# EAGLE board n64adv2 (EAGLE 9.6.2), part 1 of 2
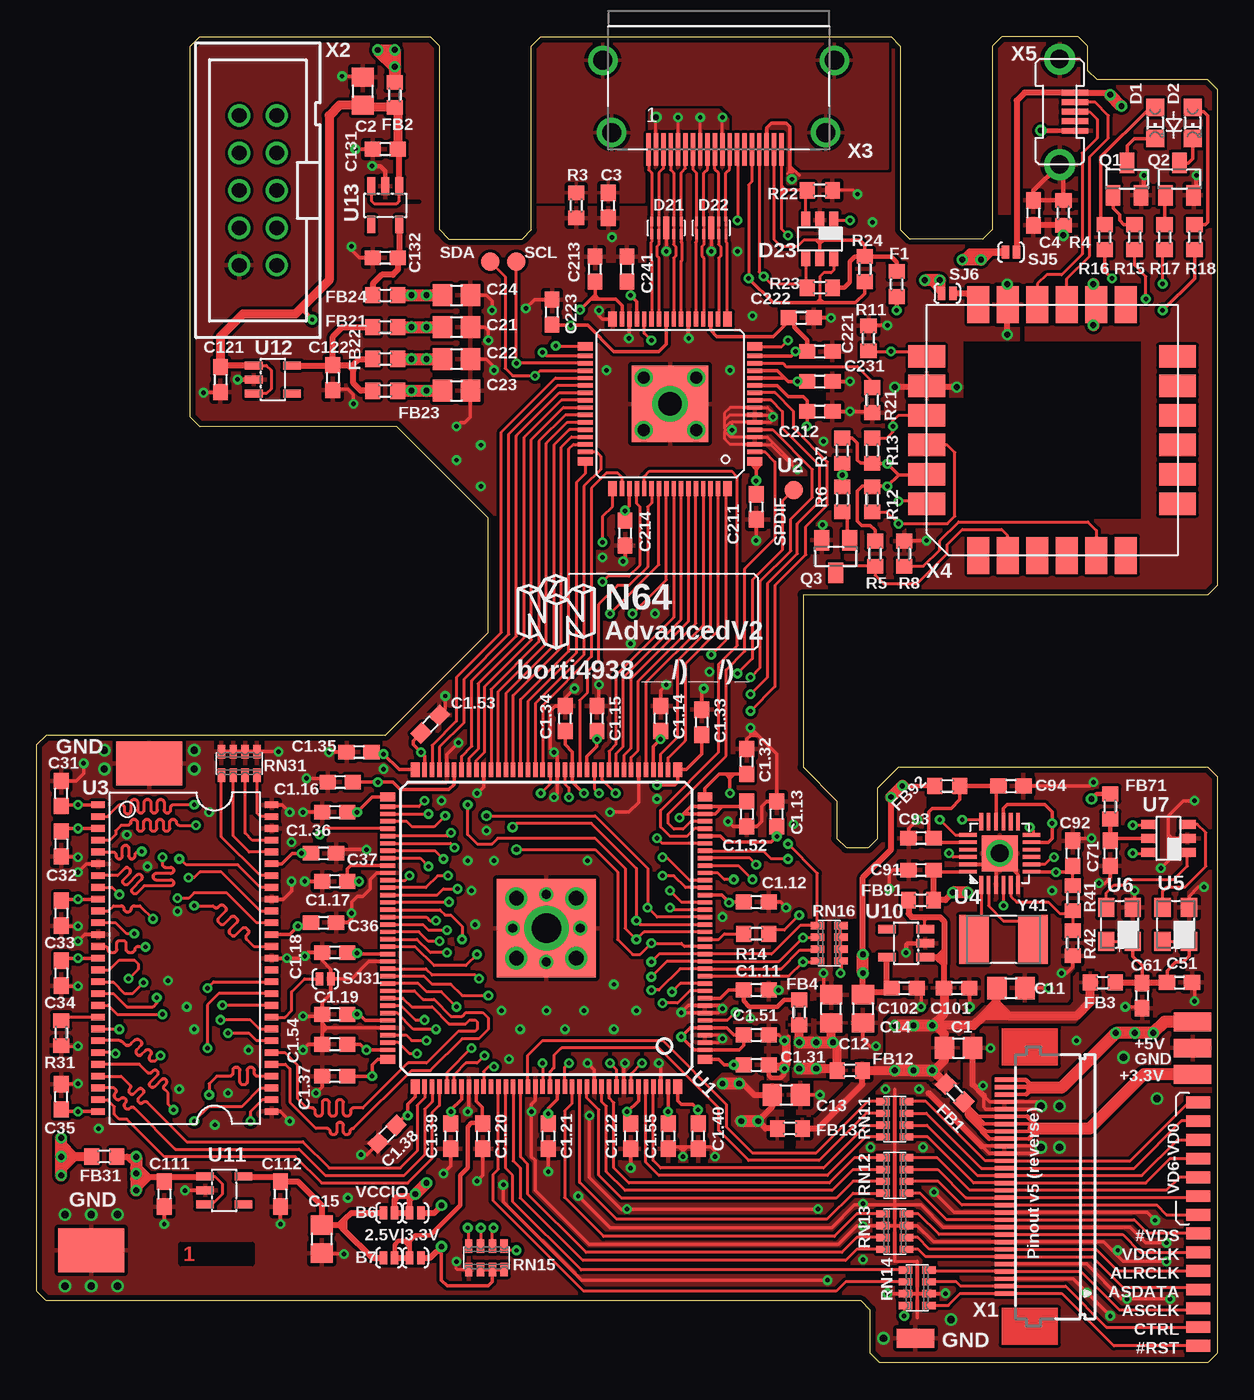
[diagram p4: board, top side]
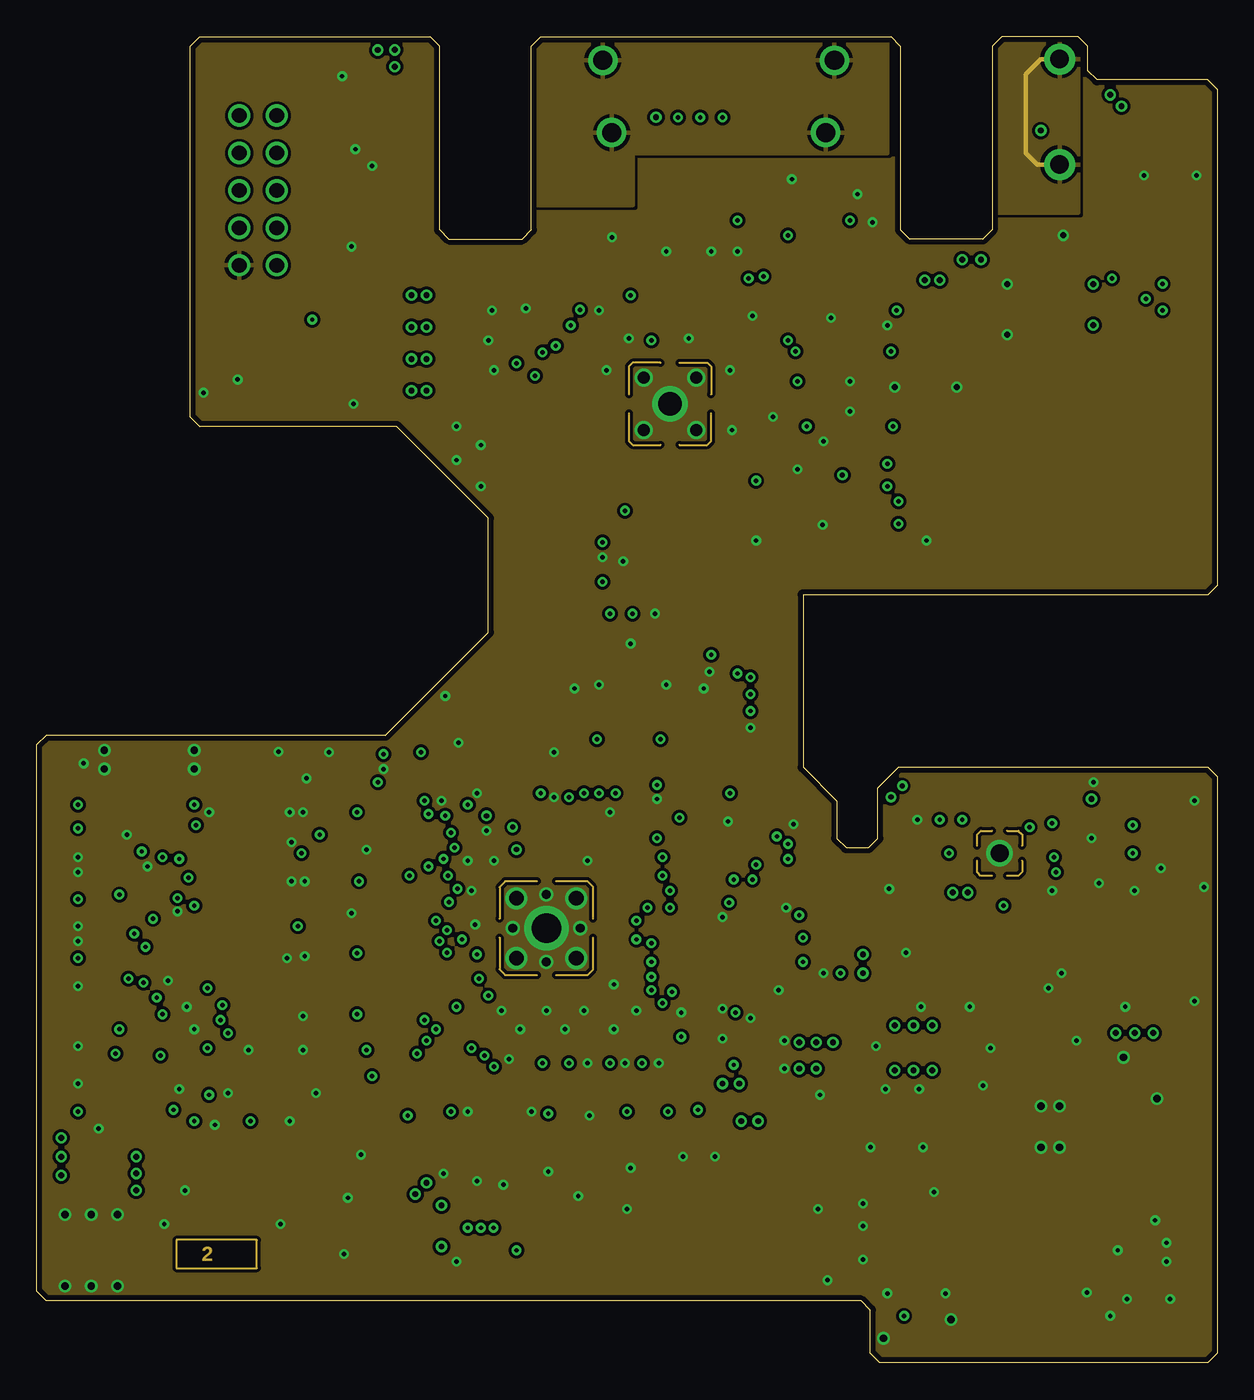
[diagram p5: board, inner layer Route2]
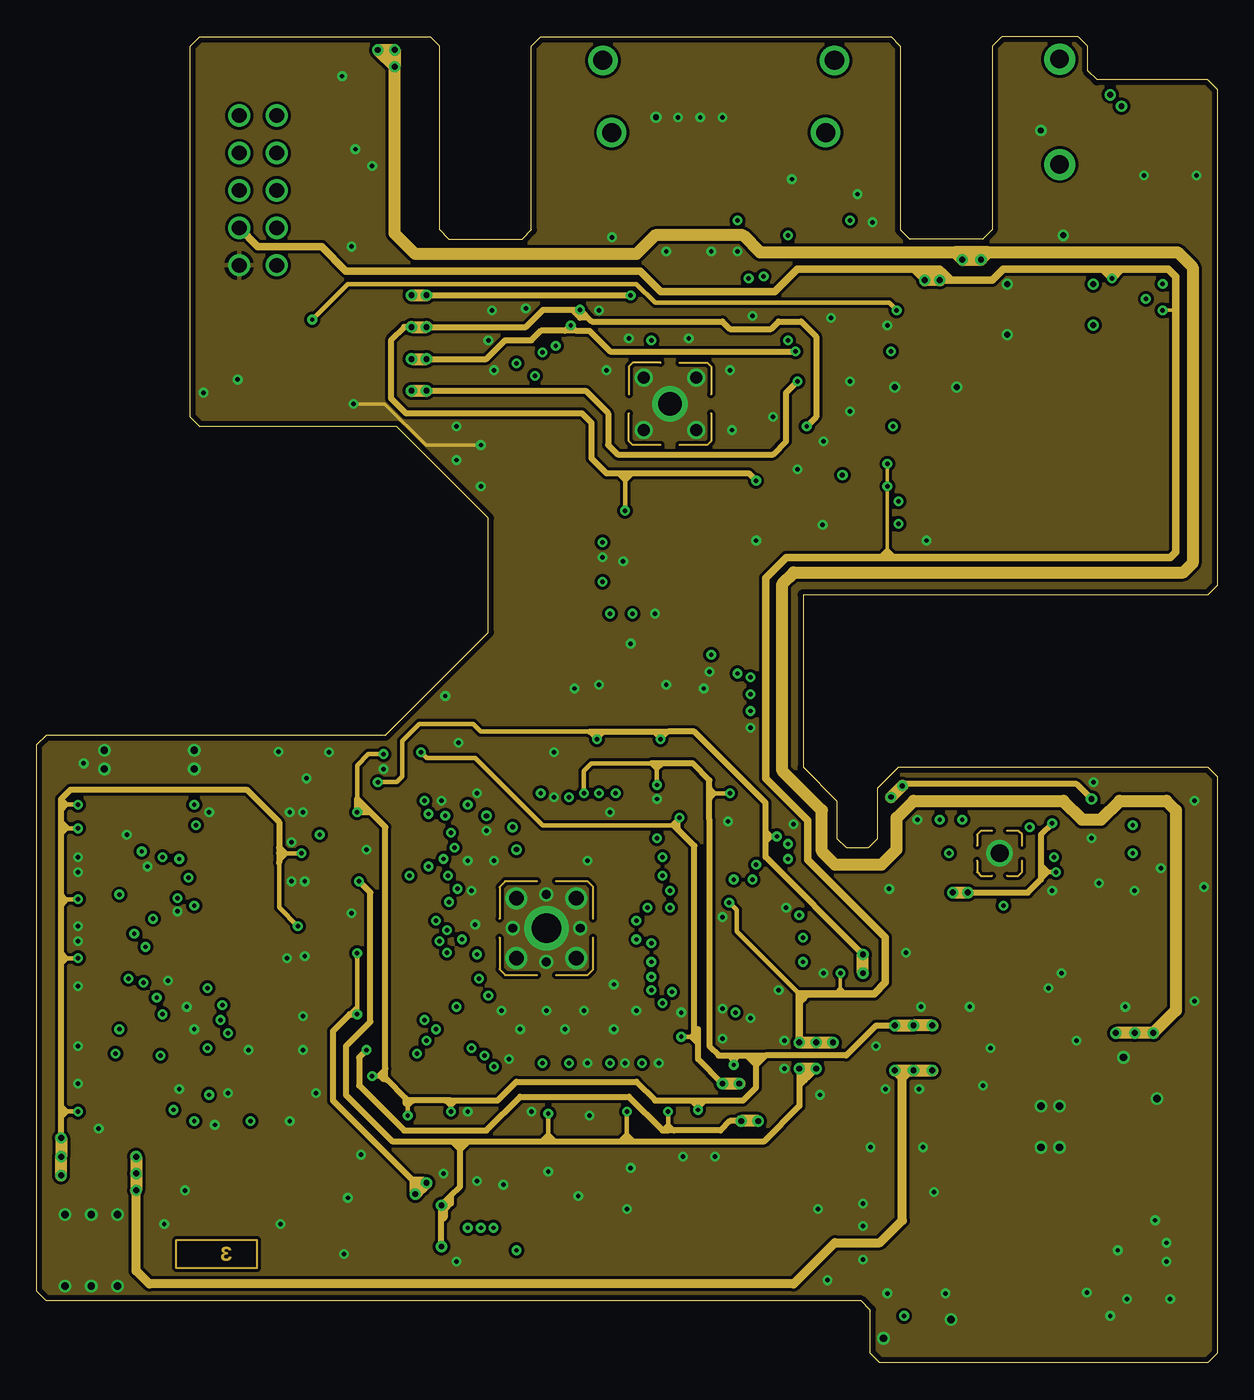
[diagram p6: board, inner layer Route15]
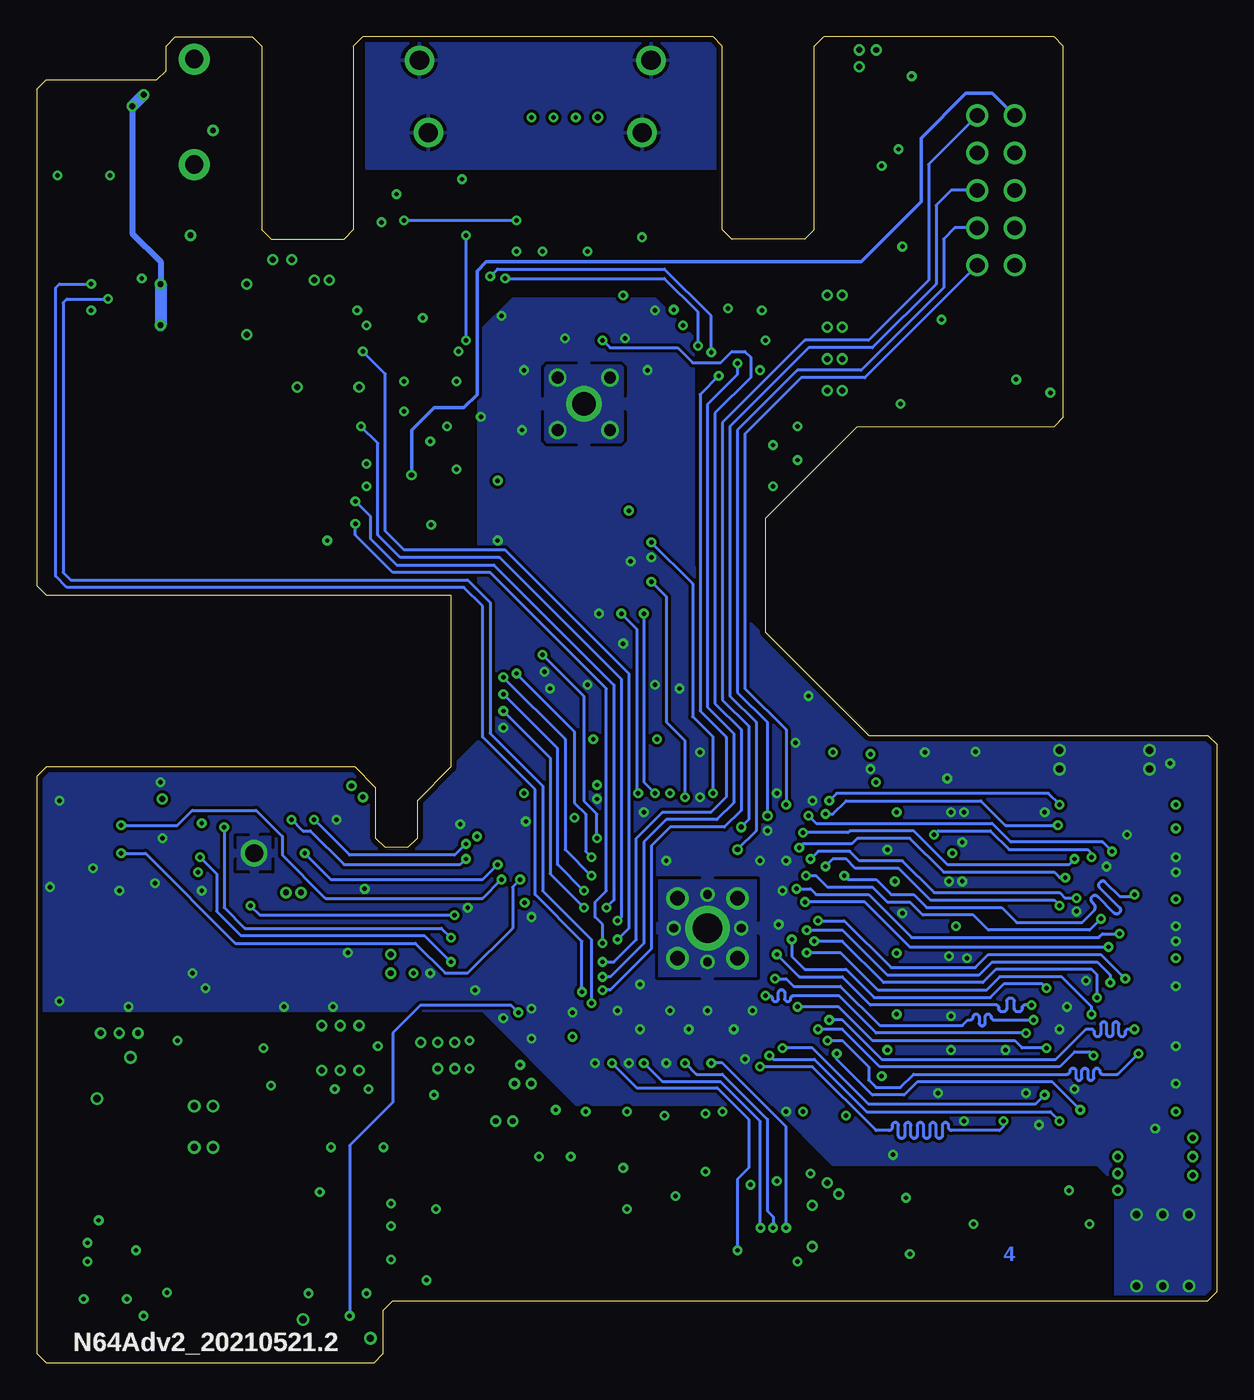
[diagram p7: board, bottom side, seen from below]

Size 80.01 x 89.92 mm. Coordinates in mm from the lower left corner, seen from the top.
Outline: 55.88,4.19 0.64,4.19 0,4.83 0,41.91 0.64,42.55 23.62,42.55 30.61,49.53 30.61,57.28 24.38,63.5 11.05,63.5 10.41,64.14 10.41,89.28 11.05,89.92 26.67,89.92 27.3,89.28 27.3,76.83 27.94,76.2 32.89,76.2 33.53,76.83 33.53,89.28 34.16,89.92 57.91,89.92 58.55,89.28 58.55,76.83 59.18,76.2 64.14,76.2 64.77,76.83 64.77,89.28 65.41,89.92 70.61,89.92 71.25,89.28 71.25,87.63 71.88,87 79.38,87 80.01,86.36 80.01,52.7 79.38,52.07 51.94,52.07 51.94,40.39 54.23,38.1 54.23,35.56 54.86,34.92 56.39,34.92 57.02,35.56 57.02,38.99 58.42,40.39 79.38,40.39 80.01,39.75 80.01,0.64 79.38,0 57.15,0 56.52,0.64 56.52,3.56 55.88,4.19
Copper layers (1+2*15+16): Top 0.0356mm / dielectric 0.2mm / Route2 0.0175mm / dielectric 1.1mm / Route15 0.0175mm / dielectric 0.2mm / Bottom 0.0356mm
Design rules "LaenPCBOrder_4Layer *": minimum track width 6mil, minimum drill 10mil, track to track 0.2mm, track to pad 0.2mm, pad to pad 0.2mm, via to via 0.2mm, smd to smd 6mil, copper to edge 15mil, drill to drill 6mil, minimum pad ring 7mil, minimum via ring 7mil, stop-mask expansion 3mil, vias tented up to drill 30mil, thermal gap 10mil
tRestrict: area 9.7,6.6 to 14.7,8.1; 17 lines
bRestrict: area 9.7,6.6 to 14.7,8.1; 28 lines

## Footprints (pad centres in the part's own frame; a part is rotated, then mirrored left to right if it is on the bottom)
SMD1,27-2,54 = smd 1.27 x 2.54: 1 0,0
SMD0,8-1,6 = smd 0.8 x 1.6: P$1 0,0
C0805 = smd 1.3 x 1.5: 1 -0.95,0; 2 0.95,0
C0603 = smd 1.1 x 1: 1 -0.85,0; 2 0.85,0
CHIPLED_0805 = smd 1.2 x 1.2: A 0,-1.05; C 0,1.05
HDMI_RCLAMP = smd 0.2 x 0.675: 1 -1,-0.438; 2 -0.5,-0.438; 4 0.5,-0.438; 5 1,-0.438; 6 1,0.438; 7 0.5,0.438; 9 -0.5,0.438; 10 -1,0.438 | smd 0.4 x 1.55: 3 0,0
SOT-23-6 = smd 1.1 x 0.6: 1 -1.3,0.95; 2 -1.3,0; 3 -1.3,-0.95; 4 1.3,-0.95; 5 1.3,0; 6 1.3,0.95
R0603 = smd 1 x 1.1: 1 -0.85,0; 2 0.85,0
SOT23 = smd 1 x 1.4: 1 -0.95,-1.1; 2 0.95,-1.1; 3 0,1.1
CTS742C083 = smd 0.5 x 0.9: 1 -1.2,-0.8; 2 -0.4,-0.8; 3 0.4,-0.8; 4 1.2,-0.8; 5 1.2,0.8; 6 0.4,0.8; 7 -0.4,0.8; 8 -1.2,0.8
GND_FINGER_PAD = smd 4.5 x 3: P$1 0,0
SJ_SMALL = smd 0.508 x 0.889: 1 -0.381,0; 2 0.381,0
B1,27 = smd 1.27 x 1.27: TP 0,0
EQFP144_2 = smd 1 x 0.6: 1 -10.75,8.9; 36 -10.75,-8.9; 73 10.75,-8.9; 108 10.75,8.9 | smd 1 x 0.3: 2 -10.75,8.25; 3 -10.75,7.75; 4 -10.75,7.25; 5 -10.75,6.75; 6 -10.75,6.25; 7 -10.75,5.75; 8 -10.75,5.25; 9 -10.75,4.75; 10 -10.75,4.25; 11 -10.75,3.75; 12 -10.75,3.25; 13 -10.75,2.75; 14 -10.75,2.25; 15 -10.75,1.75; 16 -10.75,1.25; 17 -10.75,0.75; 18 -10.75,0.25; 19 -10.75,-0.25; 20 -10.75,-0.75; 21 -10.75,-1.25; 22 -10.75,-1.75; 23 -10.75,-2.25; 24 -10.75,-2.75; 25 -10.75,-3.25; 26 -10.75,-3.75; 27 -10.75,-4.25; 28 -10.75,-4.75; 29 -10.75,-5.25; 30 -10.75,-5.75; 31 -10.75,-6.25; 32 -10.75,-6.75; 33 -10.75,-7.25; 34 -10.75,-7.75; 35 -10.75,-8.25; 74 10.75,-8.25; 75 10.75,-7.75; 76 10.75,-7.25; 77 10.75,-6.75; 78 10.75,-6.25; 79 10.75,-5.75; 80 10.75,-5.25; 81 10.75,-4.75; 82 10.75,-4.25; 83 10.75,-3.75; 84 10.75,-3.25; 85 10.75,-2.75; 86 10.75,-2.25; 87 10.75,-1.75; 88 10.75,-1.25; 89 10.75,-0.75; 90 10.75,-0.25; 91 10.75,0.25; 92 10.75,0.75; 93 10.75,1.25; 94 10.75,1.75; 95 10.75,2.25; 96 10.75,2.75; 97 10.75,3.25; 98 10.75,3.75; 99 10.75,4.25; 100 10.75,4.75; 101 10.75,5.25; 102 10.75,5.75; 103 10.75,6.25; 104 10.75,6.75; 105 10.75,7.25; 106 10.75,7.75; 107 10.75,8.25 | smd 0.6 x 1: 37 -8.9,-10.75; 72 8.9,-10.75; 109 8.9,10.75; 144 -8.9,10.75 | smd 0.3 x 1: 38 -8.25,-10.75; 39 -7.75,-10.75; 40 -7.25,-10.75; 41 -6.75,-10.75; 42 -6.25,-10.75; 43 -5.75,-10.75; 44 -5.25,-10.75; 45 -4.75,-10.75; 46 -4.25,-10.75; 47 -3.75,-10.75; 48 -3.25,-10.75; 49 -2.75,-10.75; 50 -2.25,-10.75; 51 -1.75,-10.75; 52 -1.25,-10.75; 53 -0.75,-10.75; 54 -0.25,-10.75; 55 0.25,-10.75; 56 0.75,-10.75; 57 1.25,-10.75; 58 1.75,-10.75; 59 2.25,-10.75; 60 2.75,-10.75; 61 3.25,-10.75; 62 3.75,-10.75; 63 4.25,-10.75; 64 4.75,-10.75; 65 5.25,-10.75; 66 5.75,-10.75; 67 6.25,-10.75; 68 6.75,-10.75; 69 7.25,-10.75; 70 7.75,-10.75; 71 8.25,-10.75; 110 8.25,10.75; 111 7.75,10.75; 112 7.25,10.75; 113 6.75,10.75; 114 6.25,10.75; 115 5.75,10.75; 116 5.25,10.75; 117 4.75,10.75; 118 4.25,10.75; 119 3.75,10.75; 120 3.25,10.75; 121 2.75,10.75; 122 2.25,10.75; 123 1.75,10.75; 124 1.25,10.75; 125 0.75,10.75; 126 0.25,10.75; 127 -0.25,10.75; 128 -0.75,10.75; 129 -1.25,10.75; 130 -1.75,10.75; 131 -2.25,10.75; 132 -2.75,10.75; 133 -3.25,10.75; 134 -3.75,10.75; 135 -4.25,10.75; 136 -4.75,10.75; 137 -5.25,10.75; 138 -5.75,10.75; 139 -6.25,10.75; 140 -6.75,10.75; 141 -7.25,10.75; 142 -7.75,10.75; 143 -8.25,10.75 | smd 6.7 x 6.7: E 0,0
LQFP64_EP = smd 1 x 0.6: 1 -5.75,3.9; 16 -5.75,-3.9; 33 5.75,-3.9; 48 5.75,3.9 | smd 1 x 0.3: 2 -5.75,3.25; 3 -5.75,2.75; 4 -5.75,2.25; 5 -5.75,1.75; 6 -5.75,1.25; 7 -5.75,0.75; 8 -5.75,0.25; 9 -5.75,-0.25; 10 -5.75,-0.75; 11 -5.75,-1.25; 12 -5.75,-1.75; 13 -5.75,-2.25; 14 -5.75,-2.75; 15 -5.75,-3.25; 34 5.75,-3.25; 35 5.75,-2.75; 36 5.75,-2.25; 37 5.75,-1.75; 38 5.75,-1.25; 39 5.75,-0.75; 40 5.75,-0.25; 41 5.75,0.25; 42 5.75,0.75; 43 5.75,1.25; 44 5.75,1.75; 45 5.75,2.25; 46 5.75,2.75; 47 5.75,3.25 | smd 0.6 x 1: 17 -3.9,-5.75; 32 3.9,-5.75; 49 3.9,5.75; 64 -3.9,5.75 | smd 0.3 x 1: 18 -3.25,-5.75; 19 -2.75,-5.75; 20 -2.25,-5.75; 21 -1.75,-5.75; 22 -1.25,-5.75; 23 -0.75,-5.75; 24 -0.25,-5.75; 25 0.25,-5.75; 26 0.75,-5.75; 27 1.25,-5.75; 28 1.75,-5.75; 29 2.25,-5.75; 30 2.75,-5.75; 31 3.25,-5.75; 50 3.25,5.75; 51 2.75,5.75; 52 2.25,5.75; 53 1.75,5.75; 54 1.25,5.75; 55 0.75,5.75; 56 0.25,5.75; 57 -0.25,5.75; 58 -0.75,5.75; 59 -1.25,5.75; 60 -1.75,5.75; 61 -2.25,5.75; 62 -2.75,5.75; 63 -3.25,5.75 | smd 5.2 x 5.2: EXP 0,0
TSOP-54 = smd 0.9 x 0.45: 1 -5.88,10.4; 2 -5.88,9.6; 3 -5.88,8.8; 4 -5.88,8; 5 -5.88,7.2; 6 -5.88,6.4; 7 -5.88,5.6; 8 -5.88,4.8; 9 -5.88,4; 10 -5.88,3.2; 11 -5.88,2.4; 12 -5.88,1.6; 13 -5.88,0.8; 14 -5.88,0; 15 -5.88,-0.8; 16 -5.88,-1.6; 17 -5.88,-2.4; 18 -5.88,-3.2; 19 -5.88,-4; 20 -5.88,-4.8; 21 -5.88,-5.6; 22 -5.88,-6.4; 23 -5.88,-7.2; 24 -5.88,-8; 25 -5.88,-8.8; 26 -5.88,-9.6; 27 -5.88,-10.4; 28 5.88,-10.4; 29 5.88,-9.6; 30 5.88,-8.8; 31 5.88,-8; 32 5.88,-7.2; 33 5.88,-6.4; 34 5.88,-5.6; 35 5.88,-4.8; 36 5.88,-4; 37 5.88,-3.2; 38 5.88,-2.4; 39 5.88,-1.6; 40 5.88,-0.8; 41 5.88,0; 42 5.88,0.8; 43 5.88,1.6; 44 5.88,2.4; 45 5.88,3.2; 46 5.88,4; 47 5.88,4.8; 48 5.88,5.6; 49 5.88,6.4; 50 5.88,7.2; 51 5.88,8; 52 5.88,8.8; 53 5.88,9.6; 54 5.88,10.4
QFN-24-DIY = smd 2.45 x 2.45: EXP 0,0 | smd 1.2 x 0.25: P1 -2.15,1.25; P2 -2.15,0.75; P3 -2.15,0.25; P4 -2.15,-0.25; P5 -2.15,-0.75; P6 -2.15,-1.25; P13 2.15,-1.25; P14 2.15,-0.75; P15 2.15,-0.25; P16 2.15,0.25; P17 2.15,0.75; P18 2.15,1.25 | smd 0.25 x 1.2: P7 -1.25,-2.15; P8 -0.75,-2.15; P9 -0.25,-2.15; P10 0.25,-2.15; P11 0.75,-2.15; P12 1.25,-2.15; P19 1.25,2.15; P20 0.75,2.15; P21 0.25,2.15; P22 -0.25,2.15; P23 -0.75,2.15; P24 -1.25,2.15
3.2X2.5_KXO-V96 = smd 1.3 x 1.1: 1 -1.15,-0.9; 2 1.15,-0.9; 3 1.15,0.9; 4 -1.15,0.9
SOT23-5 = smd 0.55 x 1.2: 1 -0.95,-1.3; 2 0,-1.3; 3 0.95,-1.3; 4 0.95,1.3; 5 -0.95,1.3
FH12-30S-0.5SH = smd 0.3 x 1.3: 1 -7.25,3.25; 2 -6.75,3.25; 3 -6.25,3.25; 4 -5.75,3.25; 5 -5.25,3.25; 6 -4.75,3.25; 7 -4.25,3.25; 8 -3.75,3.25; 9 -3.25,3.25; 10 -2.75,3.25; 11 -2.25,3.25; 12 -1.75,3.25; 13 -1.25,3.25; 14 -0.75,3.25; 15 -0.25,3.25; 16 0.25,3.25; 17 0.75,3.25; 18 1.25,3.25; 19 1.75,3.25; 20 2.25,3.25; 21 2.75,3.25; 22 3.25,3.25; 23 3.75,3.25; 24 4.25,3.25; 25 4.75,3.25; 26 5.25,3.25; 27 5.75,3.25; 28 6.25,3.25; 29 6.75,3.25; 30 7.25,3.25
PAK100/2500-10 = drill 1 pad 1.422: 1 -5.08,-1.27; 2 -5.08,1.27; 3 -2.54,-1.27; 4 -2.54,1.27; 5 0,-1.27; 6 0,1.27; 7 2.54,-1.27; 8 2.54,1.27; 9 5.08,-1.27; 10 5.08,1.27
685119134923 = smd 0.3 x 2.2: 1 4.75,0.15; 2 4.25,0.15; 3 3.75,0.15; 4 3.25,0.15; 5 2.75,0.15; 6 2.25,0.15; 7 1.75,0.15; 8 1.25,0.15; 9 0.75,0.15; 10 0.25,0.15; 11 -0.25,0.15; 12 -0.75,0.15; 13 -1.25,0.15; 14 -1.75,0.15; 15 -2.25,0.15; 16 -2.75,0.15; 17 -3.25,0.15; 18 -3.75,0.15; 19 -4.25,0.15 | drill 1.3 pad 2: SHELL -7.25,-1; SHELL1 7.25,-1; SHELL2 -7.85,-5.9; SHELL3 7.85,-5.9
TEI0005 = smd 2.5 x 1.5: 1 -8.5,5; 2 -8.5,3; 3 -8.5,1; 4 -8.5,-1; 5 -8.5,-3; 6 -8.5,-5; 13 8.5,-5; 14 8.5,-3; 15 8.5,-1; 16 8.5,1; 17 8.5,3; 18 8.5,5 | smd 1.5 x 2.5: 7 -5,-8.5; 8 -3,-8.5; 9 -1,-8.5; 10 1,-8.5; 11 3,-8.5; 12 5,-8.5; 19 5,8.5; 20 3,8.5; 21 1,8.5; 22 -1,8.5; 23 -3,8.5; 24 -5,8.5
USB-MICRO-VERTICAL-DIY = smd 0.4 x 1.8: 1 -1.3,1.04; 2 -0.65,1.04; 3 0,1.04; 4 0.65,1.04; 5 1.3,1.04 | drill 1.25 pad 2.1: 6 -3.575,0; 7 3.575,0
5.0X3.2_2 = smd 2 x 3.3: 1 -2,0; 2 2,0

## Placement (x,y rotation side)
3V_IN  [SMD1,27-2,54]  78.36,19.56 90 top
#RST  SMD1  [SMD0,8-1,6]  78.74,1.14 90 top
#VDS  SMD1  [SMD0,8-1,6]  78.74,8.76 270 top
ALRCLK  SMD1  [SMD0,8-1,6]  78.74,6.22 270 top
ASCLK  SMD1  [SMD0,8-1,6]  78.74,3.68 270 top
ASDATA  SMD1  [SMD0,8-1,6]  78.74,4.95 270 top
C1  47u  [C0805]  62.48,21.34 0 top
C1.11  0.1u  [C0603]  48.77,25.27 0 top
C1.12  0.1u  [C0603]  48.77,31.24 0 top
C1.13  0.1u  [C0603]  50.16,37.21 90 top
C1.14  0.1u  [C0603]  42.29,43.69 90 top
C1.15  0.1u  [C0603]  37.97,43.69 90 top
C1.16  0.1u  [C0603]  20.57,39.37 180 top
C1.17  0.1u  [C0603]  20.19,32.64 180 top
C1.18  0.1u  [C0603]  20.19,27.81 180 top
C1.19  0.1u  [C0603]  20.19,23.62 180 top
C1.20  0.1u  [C0603]  30.23,15.37 270 top
C1.21  0.1u  [C0603]  34.67,15.37 270 top
C1.22  0.1u  [C0603]  40.26,15.37 270 top
C1.31  0.1u  [C0603]  48.77,20.19 0 top
C1.32  0.1u  [C0603]  48.13,40.77 90 top
C1.33  0.1u  [C0603]  45.09,43.43 90 top
C1.34  0.1u  [C0603]  35.81,43.69 90 top
C1.35  0.1u  [C0603]  21.84,41.4 180 top
C1.36  0.1u  [C0603]  20.19,37.34 180 top
C1.37  0.1u  [C0603]  20.19,19.43 180 top
C1.38  0.1u  [C0603]  23.75,15.49 225 top
C1.39  0.1u  [C0603]  28.07,15.37 270 top
C1.40  0.1u  [C0603]  44.83,15.37 270 top
C1.51  0.1u  [C0603]  48.77,22.23 0 top
C1.52  0.1u  [C0603]  48.13,37.21 270 top
C1.53  0.1u  [C0603]  26.67,43.31 45 top
C1.54  0.1u  [C0603]  20.19,21.59 180 top
C1.55  0.1u  [C0603]  42.8,15.37 270 top
C2  47u  [C0805]  22.1,86.23 90 top
C3  0.1u  [C0603]  38.73,78.49 90 top
C4  0.1u  [C0603]  67.56,77.98 90 top
C11  10u  [C0805]  66.04,25.4 0 top
C12  10u  [C0805]  53.85,24 90 top
C13  10u  [C0805]  50.8,18.16 0 top
C14  10u  [C0805]  56.01,24 270 top
C15  10u  [C0805]  19.3,8.38 270 top
C21  10u  [C0805]  28.45,70.23 0 top
C22  10u  [C0805]  28.45,68.07 0 top
C23  10u  [C0805]  28.45,65.91 0 top
C24  10u  [C0805]  28.45,72.39 0 top
C31  0.1u  [C0603]  1.65,38.61 90 top
C32  0.1u  [C0603]  1.65,35.18 270 top
C33  0.1u  [C0603]  1.65,30.48 270 top
C34  0.1u  [C0603]  1.65,26.42 270 top
C35  0.1u  [C0603]  1.65,18.03 90 top
C36  0.1u  [C0603]  19.43,29.84 0 top
C37  0.1u  [C0603]  19.43,34.54 0 top
C51  0.01u  [C0603]  77.47,25.78 0 top
C61  0.01u  [C0603]  74.93,24.89 270 top
C71  0.1u  [C0603]  72.77,34.54 270 top
C91  0.1u  [C0603]  59.94,33.4 180 top
C92  0.1u  [C0603]  70.23,34.54 90 top
C93  0.1u  [C0603]  59.94,35.56 180 top
C94  0.1u  [C0603]  66.04,39.12 0 top
C101  1u  [C0603]  62.36,25.4 0 top
C102  1u  [C0603]  58.8,25.4 0 top
C111  1u  [C0603]  8.64,11.43 270 top
C112  1u  [C0603]  16.51,11.43 270 top
C121  1u  [C0603]  12.45,66.67 270 top
C122  1u  [C0603]  20.07,66.8 270 top
C131  1u  [C0603]  23.62,82.3 180 top
C132  1u  [C0603]  23.62,74.93 180 top
C211  0.1u  [C0603]  48.77,58.04 270 top
C212  0.1u  [C0603]  53.09,64.52 0 top
C213  0.1u  [C0603]  37.85,74.17 90 top
C214  0.1u  [C0603]  39.88,56.26 270 top
C221  0.1u  [C0603]  53.09,68.58 0 top
C222  0.1u  [C0603]  51.82,70.87 0 top
C223  0.1u  [C0603]  34.92,71.25 90 top
C231  0.1u  [C0603]  53.09,66.55 0 top
C241  0.1u  [C0603]  40.01,74.17 90 top
CTRL  SMD1  [SMD0,8-1,6]  78.74,2.41 90 top
D1  LTST-C194KRKT  [CHIPLED_0805]  75.82,84.07 180 top
D2  LTST-C194KGKT  [CHIPLED_0805]  78.36,84.07 180 top
D21  RCLAMP0524PATCT  [HDMI_RCLAMP]  42.67,76.96 0 top
D22  RCLAMP0524PATCT  [HDMI_RCLAMP]  45.72,76.96 180 top
D23  2G17TI_DBV  [SOT-23-6]  53.09,76.2 270 top
F1  [R0603]  58.29,73.15 90 top
FB1  MPZ1608S221A  [R0603]  62.23,18.29 135 top
FB2  MPZ1608S221A  [R0603]  24.26,85.98 270 top
FB3  MPZ1608S221A  [R0603]  72.26,25.78 0 top
FB4  MPZ1608S221A  [R0603]  51.69,23.75 90 top
FB12  MPZ1608S221A  [R0603]  55.12,19.81 180 top
FB13  MPZ1608S221A  [R0603]  51.05,15.88 180 top
FB21  MPZ1608S221A  [R0603]  23.62,70.23 0 top
FB22  MPZ1608S221A  [R0603]  23.62,68.07 0 top
FB23  MPZ1608S221A  [R0603]  23.62,65.91 0 top
FB24  MPZ1608S221A  [R0603]  23.62,72.39 0 top
FB31  MPZ1608S221A  [R0603]  4.57,13.97 180 top
FB71  MPZ1608S221A  [R0603]  72.77,37.72 270 top
FB91  MPZ1608S221A  [R0603]  59.94,31.37 0 top
FB92  MPZ1608S221A  [R0603]  61.72,39.12 0 top
P_5V_IN  [SMD1,27-2,54]  78.36,23.11 270 top
P_GND_2  [SMD1,27-2,54]  59.56,1.65 90 top
P_GND_3  [SMD1,27-2,54]  78.36,21.34 90 top
Q1  2N2222  [SOT23]  73.91,80.26 0 top
Q2  2N2222  [SOT23]  77.47,80.26 0 top
Q3  2N2222  [SOT23]  54.17,54.67 180 top
R3  1M  [R0603]  36.58,78.49 90 top
R4  1M  [R0603]  69.6,77.98 90 top
R5  1k  [R0603]  56.83,54.86 90 top
R6  1k  [R0603]  54.61,58.55 270 top
R7  1k  [R0603]  54.61,61.85 90 top
R8  10k  [R0603]  58.8,54.86 270 top
R11  1k  [R0603]  56.39,69.47 90 top
R12  10k  [R0603]  56.64,58.55 90 top
R13  10k  [R0603]  56.64,61.85 270 top
R14  33  [R0603]  48.77,29.08 180 top
R15  1k  [R0603]  74.42,76.33 270 top
R16  330  [R0603]  72.39,76.33 270 top
R17  1k  [R0603]  76.45,76.33 270 top
R18  330  [R0603]  78.49,76.33 270 top
R21  887  [R0603]  56.64,65.28 90 top
R22  10k  [R0603]  53.09,79.5 180 top
R23  2k  [R0603]  53.09,72.9 180 top
R24  2k  [R0603]  56.13,74.17 270 top
R31  1k  [R0603]  1.65,22.35 270 top
R41  3k09  [R0603]  70.23,31.5 270 top
R42  1k58  [R0603]  70.23,28.45 90 top
RN11  BK32164M121-T  [CTS742C083]  58.17,16.51 270 top
RN12  BK32164M121-T  [CTS742C083]  58.17,12.7 270 top
RN13  BK32164M121-T  [CTS742C083]  58.17,8.89 270 top
RN14  BK32164M121-T  [CTS742C083]  59.69,5.08 270 top
RN15  CAY16-103J4LF  [CTS742C083]  30.48,7.11 180 top
RN16  CAY16-2201F4LF  [CTS742C083]  53.72,28.45 270 top
RN31  CAY16-103J4LF  [CTS742C083]  13.72,40.64 0 top
SF_GND_1  PADSHIELD_FINGER  [GND_FINGER_PAD]  7.62,40.64 180 top
SF_GND_2  PADSHIELD_FINGER  [GND_FINGER_PAD]  3.68,7.62 0 top
SJ1  [SJ_SMALL]  25.65,10.16 180 top
SJ2  [SJ_SMALL]  25.65,7.11 180 top
SJ3  [SJ_SMALL]  23.88,7.11 180 top
SJ4  [SJ_SMALL]  23.88,10.16 180 top
SJ5  [SJ_SMALL]  66.04,75.31 180 top
SJ6  [SJ_SMALL]  61.72,72.52 180 top
SJ31  [SJ_SMALL]  19.56,26.04 0 top
TP_SCL  TPB1,27  [B1,27]  32.51,74.68 0 top
TP_SDA  TPB1,27  [B1,27]  30.73,74.68 0 top
TP_SPDIF  TPB1,27  [B1,27]  51.31,59.18 0 top
U1  10M16SCE144/10M25SCE144  [EQFP144_2]  34.54,29.46 180 top
U2  ADV7513  [LQFP64_EP]  42.93,65.02 180 top
U3  MT48LC16M16A2-TSOP54  [TSOP-54]  10.03,27.43 0 top
U4  SI5356DIY  [QFN-24-DIY]  65.28,34.54 90 top
U5  ASE-50.000MHZ-LC-T  [3.2X2.5_KXO-V96]  77.22,29.72 90 top
U6  ASE-24.576MHZ-LC-T  [3.2X2.5_KXO-V96]  73.41,29.72 90 top
U7  2G17TI_DBV  [SOT-23-6]  76.71,35.56 180 top
U10  TLV70225DBVR  [SOT23-5]  58.93,28.45 90 top
U11  TLV70025  [SOT23-5]  12.7,11.68 270 top
U12  TLV70218DBVT  [SOT23-5]  16,66.67 270 top
U13  TLV70033  [SOT23-5]  23.62,78.49 180 top
VD0  SMD1  [SMD0,8-1,6]  78.74,17.65 270 top
VD1  SMD1  [SMD0,8-1,6]  78.74,16.38 270 top
VD2  SMD1  [SMD0,8-1,6]  78.74,15.11 270 top
VD3  SMD1  [SMD0,8-1,6]  78.74,13.84 270 top
VD4  SMD1  [SMD0,8-1,6]  78.74,12.57 270 top
VD5  SMD1  [SMD0,8-1,6]  78.74,11.3 270 top
VD6  SMD1  [SMD0,8-1,6]  78.74,10.03 270 top
VDCLK  SMD1  [SMD0,8-1,6]  78.74,7.49 270 top
X1  FH12-30S-0.5SH  [FH12-30S-0.5SH]  68.83,11.94 90 top
X2  2510-  [PAK100/2500-10]  14.99,79.5 90 top
X3  hdmi-con  [685119134923]  46.22,82.42 180 top
X4  TEI0005  [TEI0005]  68.83,63.25 90 top
X5  USB3140-30-0170-0-C  [USB-MICRO-VERTICAL-DIY]  69.34,84.84 270 top
Y41  7A-27.000MAAJ-T  [5.0X3.2_2]  65.53,28.7 180 top

## Tracks (layer width: path | path; a pad name or v marks a point on that pad's centre or on a via)
1.8V_PRE
  Top 0.406: U12.5 20.04,67.62 C122.1 | C122.1 20.07,69.6 20.7,70.23 FB21.1 | C122.1 21.12,67.65 | 21.12,67.65 21.42,67.65 | FB22.1 21.84,68.07 21.42,67.65 | FB23.1 21.97,65.91 21.46,66.42 21.46,67.31 | 21.42,67.65 21.46,67.61 21.46,67.31 | 21.12,67.65 21.46,67.31
3.3V_PRE
  Top 0.406: U13.5 24.57,75.03 C132.1 24.47,74.13 24.13,73.79 23.37,73.79 22.77,73.19 FB24.1
3V3_IN
  Top 0.254: 64.58,15.19 X1.22 67.26,15.19 | 63.12,17.4 FB1.1 | 64.08,15.69 64.2,15.69 X1.23 67.25,15.69 67.5,15.94 67.25,16.19 X1.24 64.2,16.19 | 63.7,16.69 X1.25 67.13,16.69
  Top 0.305: 64.58,15.19 64.08,15.69 | 64.2,16.19 63.7,16.69 | 67.5,15.94 67.56,15.88 | 67.26,15.19 67.94,15.88 67.13,16.69
  Top 0.406: 64.2,15.69 63.12,16.77 63.12,17.27 | 63.12,17.27 63.12,17.4 | 63.7,16.69 63.12,17.27
  Top 0.813: 3V_IN.1 75.06,19.56 71.37,15.88 67.94,15.88 67.56,15.88
3V3_X5_OUT
  Top 0.406: X4.18 63.06,72.52 SJ6.1
5V_HDMI
  Top 0.203: X3.18 49.97,76.2 50.48,75.69 51.56,75.69 52,76.13 52.83,76.13 | 53.98,72.94 R23.1 | 53.09,75.88 53.09,76.13 | R24.1 56.13,75.14
  Top 0.254: 56.01,75.02 56.13,75.14 56.13,75.82 55.82,76.13 53.34,76.13 | 53.34,76.13 53.09,76.13 52.83,76.13 53.09,75.88 | D23.5 53.09,75.88 | 53.34,76.13 53.09,75.88
  Top 0.305: R23.1 54.74,72.9 55.12,73.28 55.12,74.68 55.46,75.02 56.01,75.02 R24.1 57.91,75.02 58.29,74.64 F1.2
5V_IN  (via drill 0.4)
  Top 0.254: X1.28 67.08,18.19
  Top 0.305: X1.30 67.05,19.19 67.55,18.69 67.42,18.69 | X1.29 67.42,18.69 | 67.42,18.69 67.44,18.67 | 67.08,18.19 67.56,18.67
  Top 0.406: v64.01,74.8 64.26,74.8 64.77,75.31
  Top 0.508: SJ5.2 64.77,75.31 63.25,75.31 v62.74,74.8
  Top 0.813: P_5V_IN.1 76.45,23.11 v75.69,22.35 v74.42,22.35 v73.15,22.35 69.47,18.67 67.56,18.67 67.44,18.67 | v24.26,87.88 v24.26,89.03 v24.25,89.02 v23.11,89.02 v24.25,87.88 v24.26,87.88 | v24.26,87.88 FB2.1 | v64.01,74.8 v62.74,74.8
  Route15 0.813: v73.15,22.35 v74.42,22.35 v75.69,22.35 77.22,23.88 77.22,37.47 76.58,38.1 73.41,38.1 72.14,36.83 70.87,36.83 69.6,38.1 59.44,38.1 58.29,36.96 58.29,34.8 57.28,33.78 54.1,33.78 53.21,34.67 53.21,37.47 50.55,40.13 50.55,52.83 51.31,53.59 77.72,53.59 78.36,54.23 78.36,74.3 77.34,75.31 64.52,75.31 | v24.26,87.88 24.26,76.58 25.65,75.18 40.64,75.18 41.91,76.45 47.88,76.45 49.02,75.31 62.23,75.31 v62.74,74.8 v64.01,74.8 64.52,75.31 | v24.26,87.88 v24.26,89.03 v23.11,89.02 v23.12,89.02 v24.26,87.88 | 64.52,75.31 62.23,75.31
+2V5_B67
  Top 0.406: 20.51,9.33 C15.1 19.3,10.67 17.69,12.28 C112.1 16.22,12.57 14.06,12.57 U11.5 | SJ4.2 21.34,10.16 20.89,9.71 | 20.51,9.33 20.89,9.71 | 20.51,9.33 20.89,8.95 | 20.89,8.95 22.73,7.11 SJ3.2 | 20.89,8.95 20.89,9.71
+3V3  (via drill 0.3, 0.4)
  Top 0.203: U11.1 12.06,12.63 12.57,12.13 12.57,11.43 11.88,10.73 U11.3 | U10.3 60.2,29.43 60.2,29.97 | 60.2,30.23 60.2,29.97 | 60.2,29.97 60.45,30.23 60.58,30.23 | 60.2,29.97 59.94,30.23
  Top 0.254: U1.1 46.24,20.56 46.61,20.19 v47.24,20.19 C1.31.1 | U1.144 43.44,17.77 43.69,17.53 44.45,17.53 v44.83,17.14 C1.40.1 | U1.115 28.79,17.87 28.07,17.14 v28.07,17.02 C1.39.1 | C1.38.1 25.02,16.76 v25.15,16.76 25.15,17.53 25.64,18.02 U1.109 | U1.108 23.1,20.56 22.73,20.19 v22.73,19.43 C1.37.1 | U1.73 22.74,38.36 v21.72,37.34 C1.36.1 | U1.72 24.56,40.21 v23.5,41.27 22.82,41.27 C1.35.1 | C1.34.1 35.81,41.91 36.29,41.43 U1.51 36.29,39.4 v37.08,38.61 | U1.36 45.29,38.94 46.27,39.92 46.74,39.92 | 46.74,39.92 46.99,39.92 | 46.99,39.92 47.28,39.92 | 47.28,39.92 C1.32.1 | C1.33.1 45.09,41.27 44.02,40.21 U1.37 43.44,39.38 43.24,39.18 v42.04,39.18 | v46.99,38.61 46.99,39.62 | 46.99,39.92 46.99,39.62 | v60.71,19.81 61.21,19.3 | 61.21,19.3 | 46.99,39.62 47.28,39.92 | 46.99,39.62 46.74,39.88 46.74,39.92
  Top 0.406: C101.1 61.51,27.01 | 61.02,27.5 U10.1 | 61.51,27.01 61.02,27.5 | U11.1 11.32,12.55 8.91,12.55 | 8.91,12.55 C111.1 | FB31.1 6.1,13.97 | 6.1,13.97 v6.73,13.97 6.73,13.44 7.62,12.55 | 6.1,13.97 6.73,13.34 6.73,13.21 | v6.73,12.83 6.96,13.06 | 6.73,12.45 6.75,12.45 6.86,12.55 7.62,12.55 | FB91.1 59.09,30.44 59.31,30.23 59.94,30.23 60.2,30.23 60.58,30.23 61.21,30.23 61.51,29.93 61.51,27.94 | 61.51,27.94 61.51,27.01 | 61.02,27.5 61.06,27.5 61.51,27.94 | FB13.1 52.96,15.88 55.97,18.88 FB12.1 | 8.91,12.55 7.62,12.55 | 7.62,12.55 6.75,11.68 v6.73,11.68
  Top 0.61: FB12.1 v58.17,19.81 | FB1.2 61.21,19.3 60.77,19.75 61.53,20.51 C1.1 61.53,22.29 60.96,22.86 v60.71,22.86 | C101.1 61.51,23.66 v60.71,22.86 | 65.87,23.53 70.48,23.53 71.41,24.46 FB3.1 | 65.87,23.53 65.02,23.53 | 65.02,23.53 64.17,23.53 | v60.71,22.86 63.5,22.86 64.17,23.53 | 65.02,23.53 65.02,24.38 | 65.02,24.38 65.02,25.33 C11.1 | 64.17,23.53 65.02,24.38 | 65.02,24.38 65.87,23.53 | v60.71,19.81
  Top 0.813: v60.71,19.81 v59.44,19.81 v58.17,19.81 | v58.17,22.86 v59.44,22.86 v60.71,22.86 | v6.73,13.97 6.73,13.21 v6.73,12.83 6.73,12.45 v6.73,11.68
  Route15 0.305: 44.83,17.78 v44.83,17.14 44.83,17.27 | v28.07,17.02 28.07,17.4 | 28.07,17.4 28.07,17.78 | v25.15,16.76 25.15,17.4 | 25.15,17.4 25.15,17.78 | v22.73,19.43 23.11,19.43 | 21.72,38.23 21.72,40.51 22.48,41.27 v23.5,41.27 | 45.59,36.96 45.59,36.83 | 47.24,20.83 v47.24,20.19 47.24,20.45 | 47.24,20.45 47.62,20.83 | 47.24,20.45 46.86,20.83 | 23.11,19.43 23.62,19.94 | 23.62,19.3 23.5,19.43 23.24,19.43 | 23.24,19.43 23.11,19.43 | 23.75,19.18 23.5,19.18 23.24,19.43 | 25.53,17.78 25.15,17.4 | 25.15,17.4 24.96,17.59 24.96,17.97 | 28.07,17.4 28.45,17.78 | 28.07,17.4 27.69,17.78 | 44.83,17.27 45.34,17.78 | 44.83,17.27 44.32,17.78 | v46.99,38.61 45.97,38.61 | 45.97,38.61 45.59,38.61 | 45.97,38.61 45.59,38.99 | 45.97,38.61 45.59,38.23 | v37.08,38.61 37.08,40.13 37.59,40.64 41.66,40.64 42.04,40.26 | v42.04,39.18 42.04,40.26 | 42.04,40.26 42.04,40.64 | 42.42,40.64 42.04,40.26
  Route15 0.406: 22.61,37.34 23.62,36.32 23.62,19.94 23.62,19.3 23.75,19.18 24.96,17.97 25.15,17.78 25.53,17.78 27.69,17.78 28.07,17.78 28.45,17.78 31.24,17.78 32.51,19.05 40.64,19.05 41.91,17.78 44.32,17.78 44.83,17.78 45.34,17.78 47.88,17.78 48.77,18.67 48.77,20.19 | v21.72,37.34 22.61,37.34 | v21.72,37.34 21.72,38.23 22.16,37.78 | 48.13,20.83 47.62,20.83 47.24,20.83 46.86,20.83 46.23,20.83 45.59,21.46 45.59,36.83 45.59,38.23 45.59,38.61 45.59,38.99 45.59,39.5 44.45,40.64 42.42,40.64 42.04,40.64 41.66,40.64 | 48.13,20.83 48.77,20.83 | 48.77,20.83 49.4,20.83 | 49.4,20.83 54.86,20.83 56.9,22.86 v58.17,22.86 | 48.77,20.19 48.77,20.57 | 48.77,20.57 48.77,20.83 | 48.77,20.19 49.15,20.57 | 49.15,20.57 49.4,20.83 | 48.77,20.57 49.15,20.57 | 48.13,20.83 48.77,20.19 | 22.61,37.34 22.16,37.78 | v21.72,37.34 22.16,37.78
  Route15 0.61: v58.17,19.81 58.67,19.3 | v6.73,11.68 6.73,6.22 7.62,5.33 51.31,5.33 54.1,8.13 57.15,8.13 58.67,9.65 58.67,19.3 | 58.67,19.3 59.18,19.81 v59.44,19.81
  Route15 0.813: v58.17,22.86 v59.44,22.86 v60.71,22.86 | v60.71,19.81 v59.44,19.81 v58.17,19.81 | v6.73,13.97 v6.73,12.83 v6.73,11.68
  pour Top: 61.47,18.29 60.45,19.3 57.28,19.3 52.45,14.48 51.05,14.48 51.05,16.51 52.83,16.51 55.37,19.05 55.37,20.32 57.15,20.32 57.66,20.83 57.66,23.11 57.91,23.37 59.94,23.37 60.71,24.13 60.71,25.91 62.23,25.91 62.23,23.88 62.74,23.37 63.5,23.37 64.26,24.13 70.1,24.13 70.36,24.51 70.36,26.16 70.61,26.42 71.63,26.42 71.88,26.16 71.88,24.64 70.36,23.11 63.5,23.11 62.48,22.1 62.48,19.05 61.72,18.29
+5V  (via drill 0.3)
  Top 0.203: U13.3 22.67,78.8 22.86,78.61 24.38,78.61 24.57,78.8 U13.1 | U12.1 15.56,67.62 15.88,67.31 15.88,66.04 15.56,65.72 U12.3
  Top 0.305: F1.1 v58.29,71.37 | v18.67,70.74 17.91,71.5
  Top 0.406: U12.1 12.64,67.62 12.45,67.82 | U13.1 24.57,82.2 C131.1
  Top 0.61: C131.1 24.47,84.91 FB2.2 22.25,85.13 C2.1 20.51,85.28 19.81,84.58 19.81,73.41 17.91,71.5 17.53,71.12 13.97,71.12 12.45,69.6 12.45,67.82 C121.1
  Route15 0.305: v58.29,71.37 57.78,71.88 41.91,71.88 40.64,73.15 21.08,73.15 v18.67,70.74
ALRCLK_FPGA_I
  Top 0.203: RN13.3 55.59,8.49 54.57,7.47 37.23,7.47 33.27,11.43 33.27,13.46 32.79,13.94 U1.123
ALRCLK_I
  Top 0.203: RN13.6 59.71,8.49 60.51,7.69 X1.7 71.81,7.69 73.28,6.22 ALRCLK.P$1
ASCLK_FPGA_I
  Top 0.203: RN14.1 36.9,6.28 32.26,10.92 32.26,12.7 31.79,13.16 U1.121
ASCLK_I
  Top 0.203: RN14.8 60.58,6.19 X1.4 70.77,6.19 73.41,3.56 78.61,3.56 ASCLK.P$1
ASDATA_FPGA_I
  Top 0.203: U1.122 32.29,13.68 32.77,13.21 32.77,11.18 37.01,6.93 54.83,6.93 55.59,7.69 RN13.4
ASDATA_I
  Top 0.203: RN13.5 59.75,7.69 60.25,7.19 X1.6 71.55,7.19 73.66,5.08 78.61,5.08 ASDATA.P$1
AUDIO_MCLK
  Top 0.203: U6.3 72.51,31.87 73.03,32.38 73.66,32.38 74.04,32.77 77.09,32.77 78.01,33.69 U7.1
AUDIO_MCLK_2V5BUF  (via drill 0.3)
  Top 0.203: U1.26 46.16,33.21 46.61,32.77 v47.24,32.77 | v74.3,34.54 75.34,34.54 U7.6
  Bottom 0.203: v74.3,34.54 72.64,34.54 66.55,28.45 54.36,28.45 52.32,26.42 50.8,26.42 47.75,29.46 47.75,32.26 v47.24,32.77
AVDD  (via drill 0.3, 0.4)
  Top 0.254: U2.25 42.68,69.09 42.17,68.58 39.12,68.58 37.34,70.36 v36.2,70.36 34.96,70.36 C223.1 | U2.15 51.13,68.27 v51.44,68.58 C221.1 | C222.1 50.97,70.65 49.91,69.6 46.1,69.6 45.68,70.02 U2.19
  Top 0.305: C222.1 51.35,70.48 51.35,70.23 52.24,69.34 C221.1
  Top 0.813: FB22.2 v25.4,68.07 v26.42,68.07 C22.1
  Route15 0.305: v36.2,70.36 36.58,69.98
  Route15 0.406: v26.42,68.07 30.48,68.07 31.75,69.34 33.53,69.34 34.16,69.98 35.81,69.98 | 35.81,69.98 v36.2,70.36 | v51.44,68.58 38.86,68.58 37.47,69.98 36.58,69.98 35.81,69.98
  Route15 0.813: v25.4,68.07 v26.42,68.07
CLK_CIRCUIT_2V5
  Top 0.254: U4.P20 61.06,35.29 C93.1 60.79,35.73 60.45,36.07 60.45,37.34 60.71,37.59 61.98,37.59 62.57,38.19 FB92.2 | U4.P16 65.03,38.95 C94.1
  Top 0.305: FB92.2 C94.1
CLK_TX
  Top 0.203: U2.53 41.18,60.1 41.53,60.45 47.12,60.45 47.5,60.07 47.5,48.64 46.23,47.37 46.23,41.4 42.29,37.47 42.29,36.32 42.93,35.69 44.07,35.69 44.6,36.21 U1.32
CONF_DONE  (via drill 0.3)
  Top 0.203: U1.138 40.29,19.59 v41.02,20.32 | v32.51,7.62 31.97,7.62 RN15.1
  Bottom 0.203: v41.02,20.32 39.35,18.65 33.89,18.65 31.75,16.51 31.75,13.21 32.51,12.45 v32.51,7.62
CONFIG_SEL  (via drill 0.3)
  Top 0.203: RN15.4 29.28,9.07 v29.21,9.14 | U1.126 v34.29,20.32
  Bottom 0.203: v29.21,9.14 29.21,16 33.53,20.32 v34.29,20.32
CTRL_FPGA_I
  Top 0.203: RN14.2 54.83,5.48 54.19,4.84 37.06,4.84 30.91,11 30.91,12.74 31.29,13.13 U1.120
CTRL_I
  Top 0.203: RN14.7 62.34,5.48 62.63,5.19 X1.2 69.74,5.19 72.52,2.41 CTRL.P$1
DQMH  (via drill 0.3)
  Top 0.203: U1.88 27.32,30.71 27.69,30.35 28.07,30.35 28.83,29.59 v28.83,28.7 | v11.56,25.4 11.99,25.83 U3.39
  Bottom 0.203: v28.83,28.7 28.83,27.56 27.94,26.67 25.15,26.67 23.24,24.77 15.37,24.77 14.41,25.72 11.87,25.72 v11.56,25.4
DQML  (via drill 0.3)
  Top 0.203: U1.89 26.43,30.21 26.67,29.97 v27.05,29.97 | U3.15 4.92,26.63 5.59,27.3 6.6,27.3 6.86,27.05 6.86,26.67 v6.22,26.04
  Bottom 0.203: v27.05,29.97 25.27,29.97 22.1,26.8 16.38,26.8 15.49,27.69 7.87,27.69 v6.22,26.04
DVDD  (via drill 0.3, 0.4)
  Top 0.203: 48.77,61.03 U2.1
  Top 0.254: 38.1,72.14 37.85,72.39 C213.1 37.85,72.43 37.57,72.16 | 38.1,72.14 39.24,72.14 39.68,71.7 U2.31 | C211.1 v48.77,59.82 48.77,60.58 | 48.77,60.58 48.77,61.03 | 48.77,60.58 48.39,60.96 | 48.77,60.58 49.02,60.83 49.02,61.09 | U2.11 50.19,66.27 50.93,65.53 51.94,65.53 52.24,65.24 C212.1 52.24,63.5 v52.2,63.5 | 37.57,72.16 v36.83,71.41 | U2.51 40.18,58.08 v39.88,57.78 C214.1 | 38.1,72.14 37.59,72.14 37.57,72.16
  Top 0.813: FB21.2 v25.4,70.23 v26.42,70.23 C21.1
  Route15 0.305: v39.88,57.78 39.88,59.82 | 39.88,59.82 39.88,60.33 | 39.88,59.82 40.39,60.33 | 39.88,59.82 39.37,60.33
  Route15 0.406: v26.42,70.23 33.15,70.23 34.33,71.41 36.32,71.41 | 37.34,70.87 36.83,70.87 36.32,71.37 36.32,71.41 | v52.2,63.5 52.83,64.14 52.83,69.6 51.82,70.61 50.29,70.61 49.78,70.1 46.99,70.1 46.48,70.61 37.63,70.61 v36.83,71.41 36.32,71.41 | v25.4,70.23 24.89,70.23 24,69.34 24,65.41 25.02,64.39 36.96,64.39 37.59,63.75 37.59,61.34 38.61,60.33 39.37,60.33 39.88,60.33 40.39,60.33 48.26,60.33 v48.77,59.82
  Route15 0.813: v25.4,70.23 v26.42,70.23
DVDD_3V3  (via drill 0.3, 0.4)
  Top 0.254: U2.29 40.68,71.97 v40.26,72.39 40.26,73.06 C241.1
  Top 0.813: FB24.2 v25.4,72.39 v26.42,72.39 C24.1
  Route15 0.406: v26.42,72.39 v40.26,72.39
  Route15 0.813: v25.4,72.39 v26.42,72.39
GND  (via drill 0.3, 0.4, 0.5, 0.6, 0.8, 1, 1.2, 1.6, 2)
  Top 0.178: 50.88,80.64 51,80.77
  Top 0.203: D21.3 v42.67,75.37 | D22.3 v45.72,75.37 | X3.2 v41.97,84.45 | X3.5 v43.47,84.45 | X3.8 v44.97,84.45 | X3.11 v46.47,84.45 | v55.63,79.25 55.37,79.5 R22.1 | 64.53,33.79 65.16,34.43 | 65.22,34.48 U4.EXP | 20.79,34.8 20.54,34.54 C37.2 | 1.69,21.46 v2.79,21.46 | U1.3 46.23,21.71 v46.48,21.97 46.24,22.21 U1.4 | RN15.5 28.49,6.31 28.45,6.35 v28.45,6.86 | v49.91,64.14 49.91,63.92 49.76,63.77 U2.6 47.12,63.77 v47.12,63.25 46.64,63.25 46.64,63.15 | v49.91,64.14 49.77,64.27 U2.7 46.98,64.27 46.61,63.91 | v49.91,64.14 49.91,64.39 49.53,64.77 U2.8 46.99,64.77 46.61,64.39 46.61,63.91 | 47.01,63.77 46.61,63.37 46.61,63.91 | 46.64,63.15 47.01,62.77 U2.4 49.53,62.77 51.18,61.12 51.18,60.86 | 46.64,63.15 46.64,62.65 47.01,62.27 U2.3 49.76,62.27 51.18,60.86 | 51.18,60.86 51.56,60.48 v51.56,60.58 | 75.06,79.36 Q1.2 | 78.61,79.36 Q2.2 | 58.17,6.86 59.69,6.86
  Top 0.229: U4.P6 66.53,33.06 65.16,34.43
  Top 0.254: C214.2 39.88,54.48 v39.75,54.36 | C211.2 v48.77,55.75 | 34.92,72.39 C223.2 33.74,72.1 v33.15,71.5 | C231.2 v55.12,66.55 | C212.2 v55.12,64.52 56.55,64.52 R21.1 | X3.17 49.47,83.76 49.78,84.07 50.8,84.07 51.05,83.82 51.05,81.15 | 51.05,81.15 51.69,80.52 | 51.05,81.15 51.05,80.82 51,80.77 51.26,80.77 | v31.62,12.06 31.62,10.92 36.96,5.59 v53.59,5.59 | v36.45,45.72 35.81,45.09 C1.34.2 35.14,44.54 34.8,44.2 34.8,41.66 35.29,41.16 U1.53 35.29,38.6 v35.05,38.35 | C1.15.2 37.97,44.58 38.1,44.7 v38.1,45.97 | C1.14.2 42.29,45.59 v42.67,45.97 | C1.33.2 45.09,45.59 v45.21,45.72 | C1.53.2 27.69,44.32 v27.69,45.21 | U4.P23 64.53,33.79 | C1.20.2 30.23,12.7 v29.84,12.32 | C1.39.2 28.07,13.34 v27.56,12.83 | C1.21.2 v34.67,12.95 | v40.26,13.21 C1.22.2 | U1.125 33.79,17.79 33.53,17.53 v33.53,17.02 33.53,13.97 33.78,13.72 33.78,11.68 37.45,8.02 54.32,8.02 55.59,9.29 RN13.2 RN13.7 59.7,9.29 60.8,8.19 X1.8 72.33,8.19 73.66,6.86 v76.58,6.86 | v36.7,11.3 38.86,9.14 53.88,9.14 55.42,10.69 59.95,10.69 61.45,9.19 X1.10 74.12,9.19 75.18,8.13 v76.58,8.13 | v52.96,10.41 v40.01,10.41 39.62,10.41 37.47,12.57 v37.47,16.76 | X1.3 70.26,5.69 v72.77,3.17 | X1.5 71.16,6.69 73.53,4.32 v76.83,4.32 | v75.82,9.65 75.28,10.19 X1.12 62.2,10.19 v60.83,11.56 | 43.52,14.64 42.93,14.64 C1.55.2 | 43.81,14.35 v43.81,13.97 | 43.81,14.35 43.56,14.61 | 43.56,14.61 43.52,14.64 | v45.97,13.97 45.97,14.35 45.68,14.64 44.96,14.64 C1.40.2 44.7,14.64 44.11,14.64 | 43.81,14.35 44.11,14.64 | C1.38.2 22.35,14.1 v21.97,14.1 | C1.37.2 19.34,18.71 v18.92,18.29 | v18.03,21.21 18.41,21.59 C1.54.2 19.34,22.39 | C1.19.2 19.22,23.5 v18.03,23.5
  Top 0.254: U3.41 18.03,27.43 v18.16,27.56 18.41,27.81 C1.18.2 19.34,27.27 19.94,26.67 SJ31.2 | C1.19.2 19.34,24.42 19.94,25.02 SJ31.2 | C36.2 21.08,29.84 21.34,30.1 v21.34,30.48 21.34,31.24 21.72,31.62 22.1,31.62 22.61,32.13 22.61,32.77 23.05,33.21 U1.83 | C1.17.2 v18.16,32.64 | v22.35,34.8 20.79,34.8 | C1.36.2 v18.03,37.34 | C1.16.2 19.47,39.62 v18.29,39.62 | C1.35.2 v19.81,41.4 | RN31.8 RN31.7 RN31.6 RN31.5 v16.38,41.44 | v3.17,40.64 3.17,39.97 2.67,39.46 C31.2 | C32.2 1.69,34.29 v2.79,34.29 | C33.2 1.69,29.59 v2.79,29.59 | C34.2 1.69,25.53 v2.79,25.53 | R31.2 1.69,21.46 | C35.2 1.69,18.92 v2.79,18.92 | C1.32.2 48.13,42.29 48.39,42.55 | 48.39,42.55 v48.39,43.05 48.51,42.93 | v46.86,36.7 47.2,36.36 C1.52.2 48.81,36.36 49.15,36.7 49.15,37.72 49.49,38.06 C1.13.2 50.16,41.27 48.9,42.55 | 48.39,42.55 48.51,42.55 | 48.51,42.55 48.9,42.55 | 48.51,42.93 48.9,42.55 | 48.51,42.55 48.51,42.93 | C102.2 59.94,25.11 v59.94,24.13 | C101.2 63.25,25.36 v63.25,24.13 | C11.2 v68.58,25.4 | R42.1 70.23,26.84 69.81,26.42 v69.47,26.42 | U6.2 74.42,30.98 v74.42,32 | C71.2 72.77,32.89 72.39,32.51 v72.01,32.51 | U7.2 76.96,35.56 | 76.96,35.56 76.71,35.81 | 76.71,35.81 76.71,37.08 77.72,38.1 v78.49,38.1 | 76.96,35.56 76.71,35.31 | 76.71,35.31 76.71,34.04 v76.2,33.53 | v79.12,32.26 78.74,32.26 78.12,31.63 U5.2 | 76.71,35.31 76.71,35.81 | C94.2 71.37,39.12 v71.63,39.37 | C92.2 70.4,35.56 v71.5,35.56 | C93.2 59.09,36.23 v59.69,36.83 | C91.2 58.04,33.4 57.78,33.15 v57.78,32.13 | C14.2 56.01,21.97 56.52,21.46 v56.9,21.46 | C1.51.2 50.29,22.23 v50.67,21.84 | C1.31.2 49.87,19.94 v50.67,19.94 | C13.2 v53.09,18.16 | 44.11,14.64 43.6,14.64 | 43.6,14.64 43.56,14.61
  Top 0.254: 43.52,14.64 43.6,14.64 | C1.11.2 v50.29,25.27 | v50.8,30.86 50.42,31.24 C1.12.2 | U1.42 40.79,38 40.13,37.34 v38.86,37.34 | U1.63 30.29,39.06 v29.84,38.61 | U1.68 27.79,41.26 v28.57,42.04 | U3.46 16.7,31.43 17.27,32 v17.27,32.64 | U3.12 3.25,29.03 v2.79,28.57 | U3.28 16.5,17.03 v17.14,16.38 | U3.6 3.35,33.83 v2.79,33.27 | C111.2 v8.64,9.4 | U11.2 v10.03,11.68 | C112.2 v16.51,9.4 | C15.2 19.37,7.37 v20.83,7.37 | C12.2 53.34,25.46 v53.34,26.42 | C51.2 78.49,25.61 v78.49,24.51 | C61.2 74.84,24.13 v73.79,24.13 | U4.P3 65.03,34.29 65.16,34.43 U4.EXP | C23.2 29.4,64.14 29.02,63.75 28.7,63.75 v28.45,63.5 | C22.2 30.48,68.07 30.99,67.56 v30.99,67.31 | C21.2 30.35,70.23 30.61,69.98 v30.61,69.34 | C24.2 30.48,72.39 30.86,72.01 v30.86,71.37 | v21.46,65.02 21.46,65.66 21.08,66.04 20.15,66.04 C122.2 | C121.2 12.41,65.79 v11.3,65.79 | C132.2 21.84,74.93 21.34,75.44 v21.34,75.69 | C131.2 v21.59,82.3 | C2.2 22.03,87.25 v20.7,87.25 | U2.30 40.18,69.51 v40.13,69.47 | U2.32 38.32,70.77 38.1,70.99 v38.1,71.37 | U2.22 44.18,69.49 v44.2,69.47 | R8.1 58.84,55.75 v60.33,55.75 | C222.2 v53.85,70.87 | R11.2 56.43,70.36 v57.66,70.36 | U1.133 37.79,19.86 v37.34,20.32 | U1.137 39.79,20.24 v39.88,20.32 | U1.142 42.29,20.19 v42.16,20.32 | U1.104 19.67,22.71 | 19.67,22.71 19.34,22.39 | 19.67,22.71 19.34,23.04 | 19.34,23.04 C1.19.2 | 19.34,22.39 19.34,22.73 | 19.34,22.73 19.34,23.04 | 19.67,22.71 19.36,22.71 19.34,22.73 | U1.116 29.29,17.1 v29.21,17.02 | v61.59,4.7 61.58,4.68 RN14.6 RN14.3 57.68,4.68 v57.66,4.7 | U1.95 22.52,27.21 21.34,26.04 SJ31.2 | U3.54 16.65,37.83 v17.14,37.34 | 58.17,18.54 58.17,6.86 | 59.69,6.86 59.69,3.05 | v53.28,56.83 53.28,55.83 Q3.2
  Top 0.254: X1.21 64.05,14.69 64.55,14.19 X1.20 67.66,14.19 v68.07,14.61 67.99,14.69 X1.21 | U1.8 44.15,24.21 v43.69,23.75 43.72,23.71 U1.7 46.19,23.71 v46.48,24 46.27,24.21 U1.8 | X1.27 64.61,17.69 64.2,18.1 64.2,17.34 64.35,17.19 X1.26 67.86,17.19 v68.07,17.4 67.78,17.69 X1.27
  Top 0.305: U10.2 59.05,28.45 58.93,28.32 v58.93,27.81 | U12.2 v13.61,66.67 | U13.2 23.62,80.8 23.27,81.15 v22.73,81.15 | v75.06,80.52 75.06,79.36 | v78.61,80.52 78.61,79.36 | X5.5 68.1,83.54 v68.07,83.57 | v50.67,19.94 50.67,20.45 | 50.67,20.45 v50.67,21.84 50.93,22.1 50.93,20.19 v50.67,19.94 | v50.67,19.94 50.42,20.19 | 50.42,20.19 49.66,20.19 | 50.42,20.19 50.67,20.45 | C1.31.2 49.62,19.47 49.78,19.3 50.42,19.3 50.67,19.56 v50.67,19.94
  Top 0.406: 64.05,14.69 60.45,18.29 | C4.1 R4.1 v69.6,76.45 | C1.2 63.43,18.86 64.2,18.1 | X4.20 60.26,66.17 | 60.26,66.17 v58.17,66.17 | v65.79,73.15 65.83,73.1 X4.17 65.79,71.7 v65.79,69.72 | v62.36,66.17 60.26,66.17
  Route15 0.254: v21.46,65.02 23.6,65.02 26.39,62.23 v30.1,62.23
  other vias: 42.93,65.02 41.15,63.25 41.15,66.8 44.7,66.8 44.7,63.25 69.34,14.61 69.34,17.4 38.99,76.33 56.64,77.34 30.1,59.44 47.5,75.37 40.26,48.77 34.54,29.46 32.51,31.5 32.51,27.43 36.58,27.43 36.58,31.5 34.54,31.75 32.26,29.46 34.54,27.18 36.83,29.46 65.28,34.54 4.57,41.53 10.67,41.53 10.67,40.26 4.57,40.26 1.91,5.21 3.68,5.21 5.46,5.21 1.91,10.03 3.68,10.03 5.46,10.03 68.83,32 8.89,25.91 10.16,24.13 10.67,22.61 9.65,18.54 12.95,18.29 14.35,21.21 12.06,16.13 4.19,15.88 6.1,35.81 11.68,37.34 29.21,34.04 27.43,38.1 29.46,32 29.72,29.72 34.54,23.88 31.5,23.88 32,20.57 32.77,22.61 40.64,23.88 39.12,25.65 37.08,23.88 35.81,22.61 39.12,22.61 37.34,34.04 30.48,36.07 30.99,34.04 28.45,61.21 41.91,50.8 38.35,54.61 45.59,46.86 57.4,1.65 61.98,2.92 56.01,6.99 56.01,9.27 56.01,10.79 60.07,14.61 59.82,18.54 57.53,18.54 70.48,21.84 64.64,21.34 64.14,18.8 73.66,20.7 75.95,17.91 48.39,23.37 48.51,70.99 38.61,67.31 46.99,67.31 53.34,62.48 46.48,30.23 56.52,14.61 7.49,33.66 17.27,35.31 9.53,30.61 21.08,11.18 23.5,40.26 16.95,27.43 35.05,41.4 42.04,38.23 51.31,36.51 73.28,7.62 71.18,4.76 73.91,4.32 51.18,80.26
  pour Route15 (rank 6): 0,0 80.01,0 80.01,89.92 0,89.92
  pour Route2 (rank 6): 0,0 80.01,0 80.01,88.9 80.01,89.92 66.55,89.92 0,89.92
  pour Top (rank 6): 0,0 80.01,0 80.01,88.9 80.01,89.92 66.55,89.92 0,89.92
  pour Bottom (rank 6): 0,42.67 24.13,42.67 35.5,54.04 35.5,69.53 38.1,72.14 47.75,72.14 50.04,69.85 50.04,42.16 51.82,40.39 80.01,40.39 80.01,23.88 49.78,23.88 43.43,17.53 30.1,17.53 26.04,13.46 8.13,13.46 6.86,12.19 6.86,4.06 0,4.06
GND_HDMI_SHIELD
  pour Top: 41.15,78.74 41.15,84.96 41.53,85.34 46.48,85.34 47.24,84.58 47.24,81.53 47.75,81.03 57.66,81.03 57.66,89.92 33.66,89.92 33.66,78.74
  pour Bottom: 57.66,81.03 33.66,81.03 33.66,89.92 57.66,89.92
  pour Route2: 33.53,78.49 40.39,78.49 40.39,82.04 57.66,82.04 57.66,89.92 33.53,89.92
HDMI_CEC  (via drill 0.3)
  Top 0.203: D23.1 55.09,77.5 v55.12,77.47 | v47.5,77.47 47.52,77.49 47.52,82.22 X3.13
  Bottom 0.203: v55.12,77.47 v47.5,77.47
HDMI_CLK_MAIN_I  (via drill 0.3)
  Top 0.203: U4.P22 62.1,34.29 v61.85,34.54 | v48.77,33.78 48.34,34.21 U1.28
  Bottom 0.203: v61.85,34.54 60.07,32.77 49.78,32.77 v48.77,33.78
HDMI_CLK_SUB_I  (via drill 0.3)
  Top 0.203: U1.29 49.23,34.71 49.78,34.16 v50.93,34.16 | v62.74,36.83 63.89,36.83 U4.P18
  Bottom 0.203: v50.93,34.16 51.31,33.78 59.18,33.78 61.47,36.07 61.98,36.07 v62.74,36.83
HDMI_HPD  (via drill 0.3)
  Top 0.203: 50.47,79.25 50.47,76.91 v50.93,76.45 | v50.93,69.34 50.51,68.92 U2.16 | X3.19 50.47,79.76 | 50.47,79.76 50.47,79.25 | 50.55,79.5 50.8,79.5 | 50.8,79.5 R22.2 52.14,79.4 D23.3 | 50.8,79.5 50.55,79.25 50.47,79.25 | 50.8,79.5 50.55,79.76 50.47,79.76
  Bottom 0.203: v50.93,76.45 v50.93,69.34
HDMI_SCL  (via drill 0.3)
  Top 0.203: X3.15 48.47,80.1 48.26,79.88 v48.26,73.53 | U2.33 35.22,68.92 v35.18,68.96 | D23.6 54.04,74.1 53.85,73.91 53.34,73.91 53.09,73.66 53.09,72.14 | 53.09,72.14 53.09,71.88 | 53.09,72.14 52.83,71.88 | 53.09,72.14 53.34,71.88
  Top 0.254: v48.26,73.53 49.91,71.88 52.83,71.88 53.09,71.88 53.34,71.88 55.5,71.88 56.13,72.52 R24.2
  Bottom 0.203: v35.18,68.96 35.18,71.25 37.47,73.53 v48.26,73.53
HDMI_SDA  (via drill 0.3)
  Top 0.203: R23.2 51.82,72.9 52.07,73.15 | 52.07,73.15 49.78,73.15 v49.28,73.66 48.97,73.96 X3.16 | U2.34 34.54,68.27 v34.29,68.53 | D23.4 52.14,73.22 52.07,73.15
  Bottom 0.203: v34.29,68.53 34.29,70.99 37.47,74.17 48.77,74.17 v49.28,73.66
HDMI_TX0+
  Top 0.2: U2.21 44.68,71.03 44.67,71.03 44.67,75.97 44.72,76.02 D22.6 D22.5 44.72,80.7 44.47,80.95 X3.7
HDMI_TX0-
  Top 0.2: U2.20 45.21,70.81 45.21,74.93 45.09,75.06 45.09,75.69 45.22,75.83 D22.7 D22.4 45.22,80.7 45.47,80.96 X3.9
HDMI_TX1+
  Top 0.2: U2.24 43.17,74.92 43.31,75.06 43.31,75.69 43.17,75.83 D21.4 D21.7 43.17,80.7 42.97,80.9 X3.4
HDMI_TX1-
  Top 0.2: U2.23 43.68,74.71 43.72,74.76 43.72,75.97 43.67,76.02 D21.5 D21.6 43.67,80.7 43.97,81 X3.6
HDMI_TX2+
  Top 0.2: U2.27 41.68,74.71 41.62,74.77 41.62,75.97 41.67,76.02 D21.1 D21.10 41.67,80.7 41.47,80.9 X3.1
HDMI_TX2-
  Top 0.2: U2.26 42.16,70.79 42.16,74.93 42.04,75.06 42.04,75.69 42.17,75.83 D21.2 D21.9 42.17,80.7 42.47,81 X3.3
HDMI_TXC+
  Top 0.2: U2.18 46.22,70.82 46.22,74.92 46.35,75.06 46.35,75.69 46.22,75.83 D22.9 D22.2 46.22,80.7 45.97,80.95 X3.10
HDMI_TXC-
  Top 0.2: U2.17 46.77,70.83 46.77,75.97 46.72,76.02 D22.10 D22.1 46.72,80.7 46.97,80.96 X3.12
I2S0  (via drill 0.3)
  Top 0.203: U2.5 49.88,63.27 52.58,60.58 52.58,58.67 51.12,57.21 51.12,55.05 49.02,52.96 49.02,47.12 v48.39,46.48 | U1.24 43.99,32.21 43.18,33.02 v42.42,33.02
  Bottom 0.203: v48.39,46.48 44.2,42.29 44.2,34.8 v42.42,33.02
INT_ADV7513  (via drill 0.3)
  Top 0.203: U2.28 41.18,69.82 v41.66,69.34 | RN16.3 52.86,27.98 51.73,27.98 50.46,26.71 U1.13 43.6,26.71 42.16,25.27 v41.66,25.27
  Bottom 0.203: v41.66,69.34 41.15,68.83 36.58,68.83 35.56,67.82 33.66,67.82 32.89,68.58 32,68.58 31.62,68.2 31.62,66.8 34.04,64.39 34.04,44.7 32.26,42.93 32.26,37.47 33.4,36.32 37.08,36.32 38.35,35.05 38.35,28.07 41.15,25.27 v41.66,25.27
INT_SI5356  (via drill 0.3)
  Top 0.203: v68.96,34.29 68.83,34.29 68.34,33.79 U4.P8 | U1.12 50.98,26.21 v51.94,27.18 52.85,27.18 RN16.4
  Bottom 0.203: v51.94,27.18 53.72,28.96 66.17,28.96 67.82,30.61 67.82,33.15 v68.96,34.29
LED1
  Top 0.254: Q1.1 72.96,78.29 73.28,77.98 73.41,77.85 73.41,77.47 73.7,77.18 R15.1
LED1_FPGA  (via drill 0.3)
  Top 0.203: U1.10 44.26,25.21 43.43,24.38 v42.42,24.38 | v75.18,72.14 75.18,73.66 74.42,74.42 R15.2
  Bottom 0.203: v42.42,24.38 42.42,28.7 45.72,32 45.72,39.12 49.28,42.67 49.28,51.56 50.8,53.09 77.72,53.09 78.23,53.59 78.23,71.88 77.98,72.14 v75.18,72.14
LED2
  Top 0.254: R17.1 76.45,79.1 Q2.1
LED2_FPGA  (via drill 0.3)
  Top 0.203: 76.16,75.74 R17.2 76.33,75.35 v76.33,73.15 | U1.11 43.62,25.71 v43.05,25.15
  Bottom 0.203: v43.05,25.15 43.05,28.57 46.23,31.75 46.23,38.86 49.78,42.42 49.78,51.31 51.05,52.58 77.98,52.58 78.74,53.34 78.74,72.9 78.49,73.15 v76.33,73.15
LRCLK  (via drill 0.3)
  Top 0.203: U2.10 50.05,65.77 51.31,64.52 51.31,63.37 53.59,61.09 53.59,58.17 52.13,56.71 52.13,54.8 50.04,52.7 50.04,45.85 v48.39,44.2 | U1.21 43.07,30.71 v42.93,30.86
  Bottom 0.203: v48.39,44.2 45.21,41.02 45.21,33.15 v42.93,30.86
N$1
  Top 0.254: R16.1 72.14,77.43 72.14,81.79 75.27,84.92 75.62,84.92
  Top 0.305: 75.62,84.92 D1.A
N$2
  Top 0.254: Q2.3 78.06,81.36 78.36,81.66 D2.C
N$3
  Top 0.254: D1.C 74.39,83.02 73.91,82.55 Q1.3
N$4
  Top 0.203: U4.P5 66.03,31.64 66.42,31.24 68.58,31.24 69.34,30.48 70.06,30.48 R41.2 R42.2
N$5
  Top 0.203: Y41.2 64.03,29.2 U4.P1
N$6
  Route15 0.152: 33.91,32.64 31.75,32.64 31.37,32.26 31.37,30.1
N$7
  Route15 0.152: 9.46,8.32 14.92,8.32 14.92,6.41 9.46,6.41 9.46,8.32
N$8
  Route2 0.152: 9.46,8.32 9.46,6.41 14.92,6.41 14.92,8.32 9.46,8.32
N$9
  Top 0.203: U4.P2 64.53,30.98 65.53,29.97 67.06,29.97 | 67.06,29.97 67.28,29.97 | Y41.1 67.53,29.5 67.06,29.97
N$10
  Route15 0.152: 31.37,28.83 31.37,26.67 31.75,26.29 33.91,26.29
N$11
  Route15 0.152: 35.18,26.29 37.34,26.29 37.72,26.67 37.72,28.83
N$12
  Route15 0.152: 37.72,30.1 37.72,32.26 37.34,32.64 35.18,32.64
N$13  (via drill 0.35)
  Top 0.254: R6.1 v54.61,60.2 R7.1
  Bottom 0.254: X2.10 15.24,86.11 17.02,86.11 20.07,83.06 20.07,78.74 24.13,74.68 49.53,74.68 50.16,74.04 50.16,65.66 51.05,64.77 53.09,64.77 54.61,63.25 v54.61,60.2
N$14
  Route2 0.152: 42.29,67.82 40.39,67.82 40.13,67.56 40.13,65.66
N$15
  Route2 0.152: 43.56,67.82 45.47,67.82 45.72,67.56 45.72,65.66
N$16
  Route2 0.152: 40.13,64.39 40.13,62.48 40.39,62.23 42.29,62.23
N$17
  Route2 0.152: 43.56,62.23 45.47,62.23 45.72,62.48 45.72,64.39
N$18
  Route2 0.152: 63.75,35.05 63.75,35.81 64.01,36.07 64.77,36.07
N$19
  Route2 0.152: 65.79,36.07 66.55,36.07 66.8,35.81 66.8,35.05
N$20
  Route2 0.152: 66.8,34.04 66.8,33.27 66.55,33.02 65.79,33.02
N$21
  Route2 0.152: 64.77,33.02 64.01,33.02 63.75,33.27 63.75,34.04
N$22
  Route15 0.152: 64.77,36.07 64.01,36.07 63.75,35.81 63.75,35.05
N$23
  Route15 0.152: 63.75,34.04 63.75,33.27 64.01,33.02 64.77,33.02
N$24
  Route15 0.152: 65.79,33.02 66.55,33.02 66.8,33.27 66.8,34.04
N$25
  Route15 0.152: 66.8,35.05 66.8,35.81 66.55,36.07 65.79,36.07
N$26
  Route2 0.152: 33.91,32.64 31.75,32.64 31.37,32.26 31.37,30.1
N$27
  Route2 0.152: 31.37,28.83 31.37,26.67 31.75,26.29 33.91,26.29
N$28
  Route2 0.152: 35.18,26.29 37.34,26.29 37.72,26.67 37.72,28.83
N$29
  Route2 0.152: 37.72,30.1 37.72,32.26 37.34,32.64 35.18,32.64
N$30
  Top 0.254: R6.2 54.93,57.38 54.93,55.96 Q3.1
N$34
  Route15 0.152: 42.29,67.82 40.39,67.82 40.13,67.56 40.13,65.66
N$35
  Route15 0.152: 43.56,67.82 45.47,67.82 45.72,67.56 45.72,65.66
N$36
  Route15 0.152: 45.72,64.39 45.72,62.48 45.47,62.23 43.56,62.23
N$37
  Route15 0.152: 42.29,62.23 40.39,62.23 40.13,62.48 40.13,64.39
N$45
  Top 0.203: U2.14 50.59,67.77 50.8,67.56 55.63,67.56 56.64,66.55 R21.2
N$99
  Top 0.254: D2.A 78.65,84.84 79.12,84.84 79.38,84.58 79.38,77.34 79.21,77.18 R18.1
NCONFIG  (via drill 0.3)
  Top 0.203: U1.129 35.79,20.05 v36.07,20.32 | v30.1,9.14 30.1,7.93 RN15.3
  Bottom 0.203: v36.07,20.32 35.31,19.56 33.53,19.56 30.48,16.51 30.48,10.29 30.1,9.91 v30.1,9.14
NRST_FPGA_IO  (via drill 0.3)
  Top 0.203: RN14.4 58.89,3.77 58.8,3.68 v58.8,3.17 | v47.37,23.75 47.37,23.72 47.33,23.72 46.82,23.21 U1.6
  Bottom 0.203: v47.37,23.75 47.88,24.26 53.98,24.26 55.88,22.35 55.88,17.65 58.8,14.73 v58.8,3.17
NRST_IO
  Top 0.203: RN14.5 61.79,3.88 62.6,4.69 X1.1 69.48,4.69 73.03,1.14 #RST.P$1
NSTATUS  (via drill 0.3)
  Top 0.203: RN15.2 30.88,9.07 v30.95,9.14 | v38.86,20.32 39.29,19.89 U1.136
  Bottom 0.203: v30.95,9.14 30.95,16.35 33.66,19.05 37.59,19.05 v38.86,20.32
NVDS_FPGA_I
  Top 0.203: RN12.4 55.33,11.5 53.56,9.72 39.3,9.72 36.79,12.23 U1.131
NVDS_I
  Top 0.203: RN12.5 59.87,11.5 61.69,9.69 X1.11 74.39,9.69 75.31,8.76 #VDS.P$1
PVDD  (via drill 0.3, 0.4)
  Top 0.203: 50.7,66.77 50.74,66.74
  Top 0.254: U2.12 50.7,66.77 50.2,67.27 U2.13 | C231.1 v51.56,66.55 50.93,66.55 50.74,66.74
  Top 0.813: FB23.2 v25.4,65.91 v26.42,65.91 C23.1
  Route15 0.406: v51.56,66.55 50.8,65.79 50.8,62.48 49.91,61.59 39.37,61.59 38.73,62.23 38.73,64.39 37.21,65.91 v26.42,65.91
  Route15 0.813: v25.4,65.91 v26.42,65.91
SCL  (via drill 0.3)
  Top 0.203: U2.35 v32.51,67.77 32.56,67.77 32.51,67.82 TP_SCL.TP | U4.P12 67.56,35.79 67.56,36.07 v67.31,36.32 | RN16.2 51.96,28.85 v51.94,28.83 50.33,27.21 U1.14 42.71,27.21 v41.66,26.16
  Bottom 0.203: v32.51,67.77 32.51,67.01 34.54,64.98 34.54,44.45 32.77,42.67 32.77,37.97 33.91,36.83 37.34,36.83 38.86,35.31 38.86,28.45 41.15,26.16 v41.66,26.16 | v67.31,36.32 67.31,30.86 65.91,29.46 52.58,29.46 v51.94,28.83
SCLK  (via drill 0.3)
  Top 0.203: U2.9 49.79,65.27 50.55,64.52 50.55,63.37 53.09,60.83 53.09,58.42 51.56,56.9 51.56,54.86 49.53,52.83 49.53,46.48 v48.39,45.34 | U1.22 43.72,31.21 v42.93,32
  Bottom 0.203: v42.93,32 44.7,33.78 44.7,41.66 v48.39,45.34
SDA  (via drill 0.3)
  Top 0.203: U2.36 34.13,67.27 v33.78,66.93 32.26,66.93 31.75,67.44 31.75,73.66 TP_SDA.TP | U4.P19 62.25,35.79 v61.21,36.83 | v41.66,27.18 42.19,27.71 U1.15 49.81,27.71 51.75,29.65 RN16.1 | RN16.1 52.96,29.69 | RN16.1 52.92,33.19 v50.93,35.18
  Bottom 0.203: v41.66,27.18 40.89,27.18 39.37,28.7 39.37,35.56 37.59,37.34 34.29,37.34 33.27,38.35 33.27,42.42 35.05,44.2 35.05,65.66 v33.78,66.93 | v50.93,35.18 51.69,34.42 58.8,34.42 v61.21,36.83
SDRAM_A0  (via drill 0.3)
  Top 0.203: v25.78,20.95 25.27,20.95 24.51,21.71 U1.106 | U3.23 6.95,20.23 7.49,19.68 arc90 7.78,19.68 7.87,19.78 arc-90 8.16,19.78 8.17,19.77 arc-90 8.17,19.49 7.69,19.01 arc90 7.69,18.73 7.7,18.72 arc90 7.98,18.72 8.46,19.2 arc-90 8.74,19.2 8.75,19.19 arc-90 8.75,18.9 8.65,18.81 arc90 8.65,18.52 8.89,18.29 8.89,17.53 v9.27,17.14
  Bottom 0.203: v9.27,17.14 11.18,19.05 20.32,19.05 21.21,18.16 23.37,18.16 25.78,20.57 v25.78,20.95
SDRAM_A1
  Top 0.203: U3.24 5.71,19.43 6.29,18.85 arc-90 6.29,18.57 arc90 6.29,18.28 6.31,18.26 arc90 6.6,18.26 6.88,18.55 arc-90 7.17,18.55 7.19,18.53 arc-90 7.19,18.24 6.9,17.96 arc90 6.9,17.67 6.92,17.65 arc90 7.21,17.65 arc-90 7.49,17.65 10.16,14.99 18.03,14.99 19.81,13.21 24.64,13.21 25.79,14.36 25.79,17.44 26.29,17.95 U1.110
SDRAM_A2
  Top 0.203: U3.25 5.24,18.63 5.31,18.56 arc-90 5.31,18.28 arc90 5.31,17.93 5.33,17.91 arc90 5.68,17.91 arc-90 5.99,17.91 arc-90 5.99,17.61 arc90 5.99,17.27 arc90 6.32,17.27 arc-90 6.6,17.27 9.4,14.48 17.78,14.48 19.56,12.7 24.89,12.7 26.29,14.09 26.29,17.19 26.79,17.7 U1.111
SDRAM_A3
  Top 0.203: U3.26 4.77,17.83 5.26,17.35 5.26,16.84 5.59,16.51 6.1,16.51 8.64,13.97 17.53,13.97 19.3,12.19 25.15,12.19 26.79,13.83 26.79,16.94 27.29,17.44 U1.112
SDRAM_A4  (via drill 0.3)
  Top 0.203: U3.29 15.29,17.83 14.48,17.02 v14.48,16.38 | v30.99,20.07 30.61,20.07 30.29,19.75 U1.118
  Bottom 0.203: v14.48,16.38 14.48,16 14.73,15.75 18,15.75 arc90 18.2,15.95 18.2,16.08 arc-90 18.4,16.29 18.42,16.29 arc-90 18.62,16.08 18.62,15.41 arc90 18.82,15.21 18.85,15.21 arc90 19.05,15.41 19.05,16.08 arc-90 19.25,16.29 19.27,16.29 arc-90 19.47,16.08 19.47,15.41 arc90 19.68,15.21 19.7,15.21 arc90 19.9,15.41 19.9,16.08 arc-90 20.1,16.29 20.12,16.29 arc-90 20.32,16.08 20.32,15.41 arc90 20.52,15.21 20.55,15.21 arc90 20.75,15.41 20.75,16.08 arc-90 20.95,16.29 20.97,16.29 arc-90 21.17,16.08 21.17,15.41 arc90 21.38,15.21 21.4,15.21 arc90 21.6,15.41 21.6,16.08 arc-90 21.8,16.29 21.82,16.29 arc-90 22.02,16.08 22.02,15.95 arc90 22.23,15.75 23.11,15.75 27.43,20.07 v30.99,20.07
SDRAM_A5  (via drill 0.3)
  Top 0.203: U1.114 28.29,19.53 29.08,20.32 29.84,20.32 v30.35,20.83 | v10.67,16.38 11.65,17.36 13.88,17.36 15.15,18.63 U3.30
  Bottom 0.203: v30.35,20.83 30.1,20.57 27.3,20.57 23.75,17.02 11.3,17.02 v10.67,16.38
SDRAM_A6  (via drill 0.3)
  Top 0.203: U3.31 14.94,19.43 arc-90 14.74,19.63 14.74,19.82 arc90 14.54,20.02 14.46,20.02 arc90 14.26,19.82 14.26,19.04 arc-90 14.05,18.84 13.97,18.84 arc-90 13.77,19.04 13.77,19.82 arc90 13.57,20.02 13.48,20.02 arc90 13.28,19.82 13.28,19.63 arc-90 13.08,19.43 12.19,19.43 11.68,18.92 v11.68,18.16 | v29.46,21.34 27.79,19.67 U1.113
  Bottom 0.203: v11.68,18.16 12.32,17.53 23.62,17.53 27.43,21.34 v29.46,21.34
SDRAM_A7
  Top 0.203: U3.32 16.85,20.23 17.14,19.94 17.14,17.65 18.92,15.88 19.68,15.88 arc-90 19.89,15.67 19.89,15.66 arc90 20.09,15.46 20.13,15.46 arc90 20.33,15.66 20.33,16.09 arc-90 20.53,16.29 20.57,16.29 arc-90 20.78,16.09 20.78,15.66 arc90 20.98,15.46 21.02,15.46 arc90 21.22,15.66 21.22,15.67 arc-90 21.42,15.88 21.46,15.88 25.4,19.81 26.67,19.81 28.83,21.97 29.97,21.97 30.61,22.61 30.61,23.37 30.23,23.75 29.08,23.75 28.83,23.5 28.07,23.5 26.92,24.64 26.16,24.64 25.59,25.21 U1.99
SDRAM_A8